# EasyEDA Pro project Ploopy-but-smaller V0.1_2025-08-17.epro, board PCB2
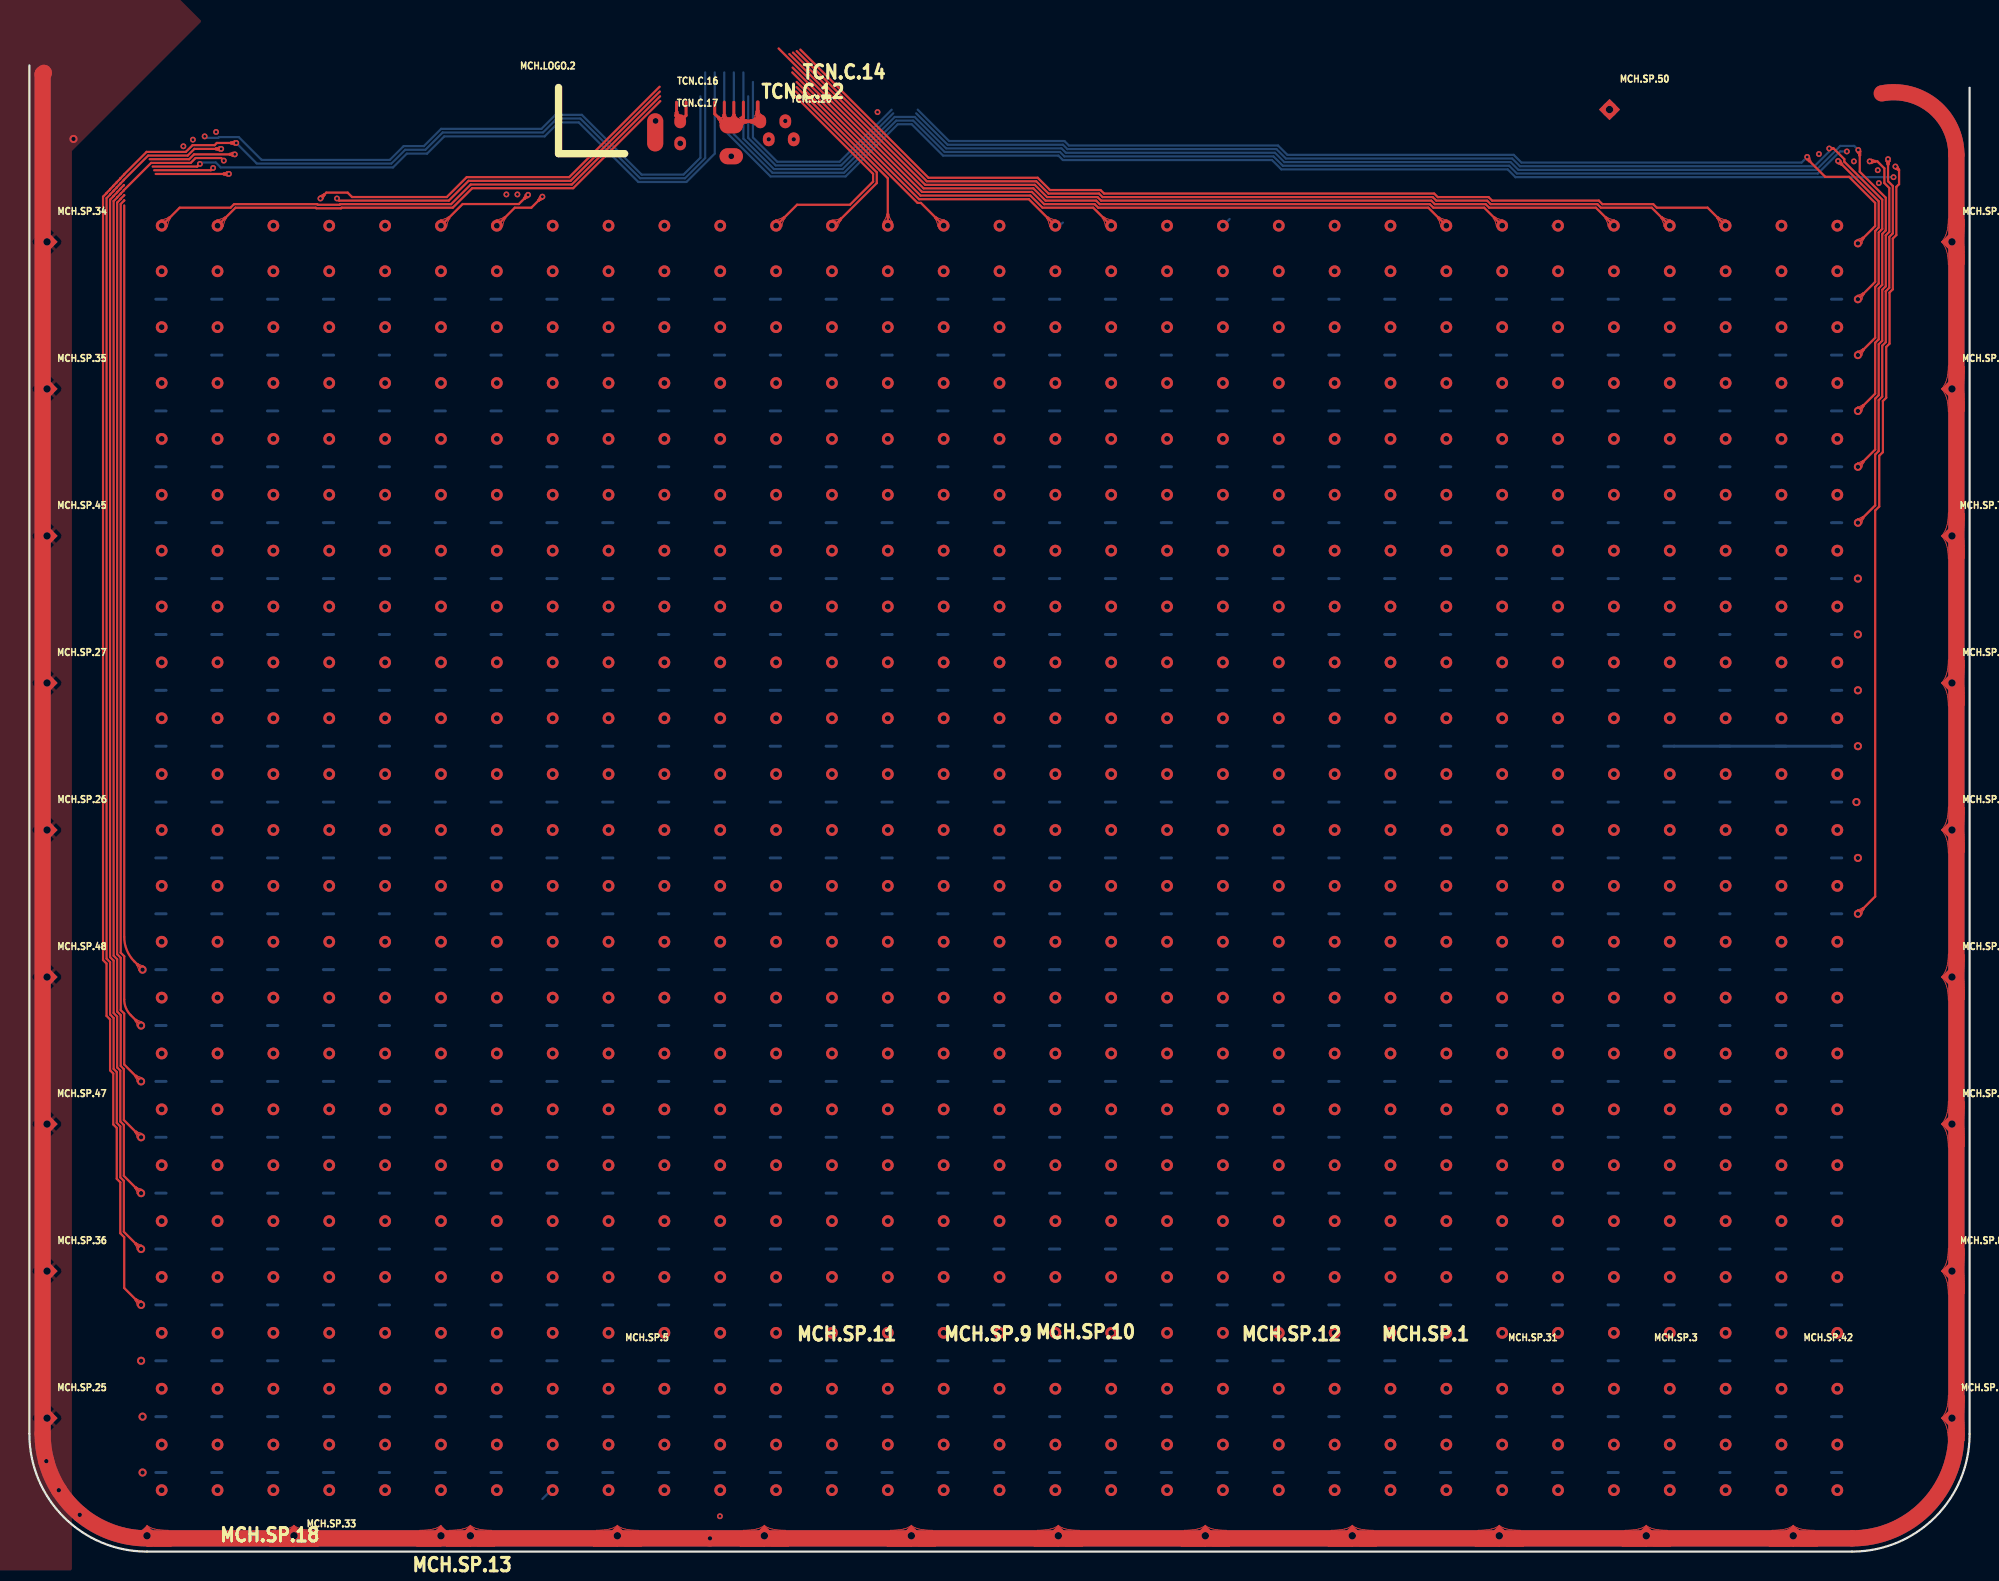
[diagram p2: board, top side]
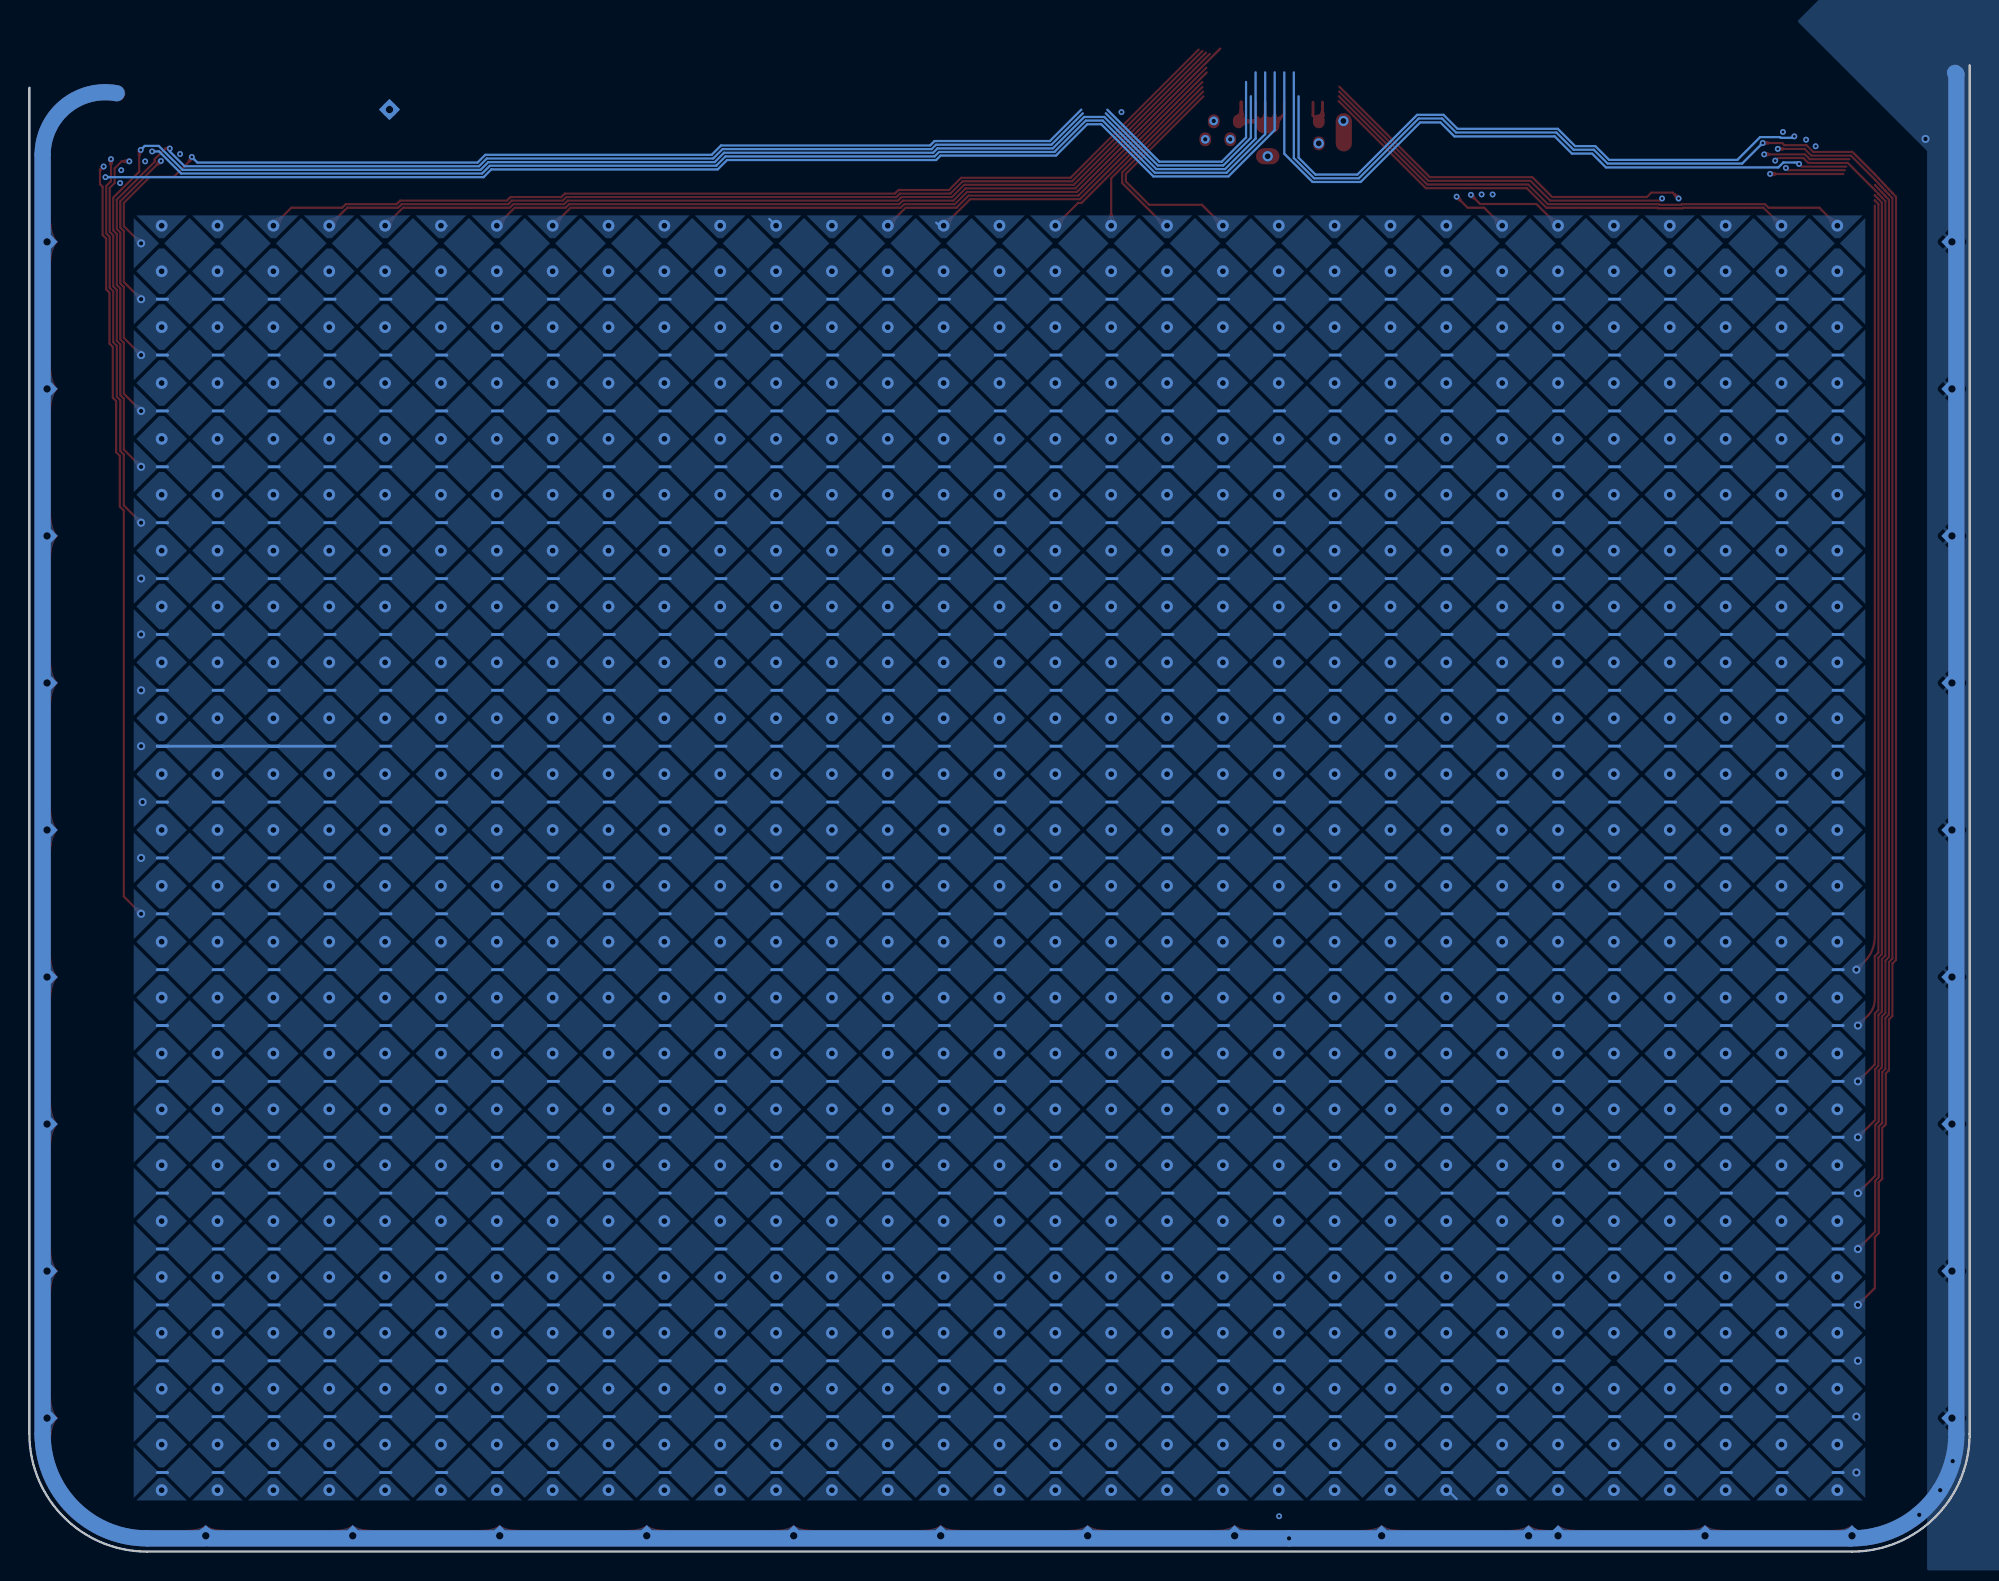
[diagram p3: board, bottom side, seen from below]

Outline 132 x 101.08 mm; copper layers: Top Layer, Inner 1, Inner 2, Inner 3, Inner 4, Bottom Layer. Coordinates in mm from the lower left corner of the outline.
Outline path: 0,101.08 0,8 arc(2.34,2.34) 8,0 124,0 arc(129.66,2.34) 132,8 132,99.56
Stack: Top Layer 0.035mm / Dielectric1 1.51mm FR4 er 4.5 / Inner 1 0.035mm / Dielectric2 0.274mm FR4 er 4.5 / Inner 2 0.035mm / Dielectric3 0.274mm PP er 4.5 / Inner 3 0.035mm / Dielectric4 0.274mm PP er 4.5 / Inner 4 0.035mm / Dielectric5 0.274mm PP er 4.5 / Bottom Layer 0.035mm

## Design rules (mm)
template: JLCPCB Capability(Two Layers Board)
spacing copperThickness1oz (default): track to track 0.102, other pairs 0.152 to 0.3
spacing copperThickness2oz: track to track 0.203, other pairs 0.152 to 0.3
track width copperThickness1oz (default): min 0.127, default 0.254, max 2.54
track width copperThickness2oz: min 0.203, default 0.254, max 2.54
differential pair differentialPair (default): width min 0.127, default 0.254, max 2.54; gap min 0.152, default 0.152
via viaSize (default): diameter min 0.5, default 0.61, max 10; hole min 0.3, default 0.305, max 6.3

## Placement (name value [footprint] x y rotation side)
MCH.LOGO.2  Coordinate system marker for assembly  [Graphics:Coordinate System]  36 95.08 0 top
MCH.SP.1  Spark Gap  [PCBFeatures:SparkGap]  90 1.07 90 top
MCH.SP.3  Spark Gap  [PCBFeatures:SparkGap]  110 1.07 90 top
MCH.SP.5  Spark Gap  [PCBFeatures:SparkGap]  40 1.07 90 top
MCH.SP.7  Spark Gap  [PCBFeatures:SparkGap]  130.8 69.08 90 top
MCH.SP.8  Spark Gap  [PCBFeatures:SparkGap]  130.8 19.08 90 top
MCH.SP.9  Spark Gap  [PCBFeatures:SparkGap]  60 1.07 90 top
MCH.SP.10  Spark Gap  [PCBFeatures:SparkGap]  70 1.07 90 top
MCH.SP.11  Spark Gap  [PCBFeatures:SparkGap]  50 1.07 90 top
MCH.SP.12  Spark Gap  [PCBFeatures:SparkGap]  80 1.07 90 top
MCH.SP.13  Spark Gap  [PCBFeatures:SparkGap]  30 1.07 90 top
MCH.SP.16  Spark Gap  [PCBFeatures:SparkGap]  130.8 89.08 90 top
MCH.SP.17  Spark Gap  [PCBFeatures:SparkGap]  130.8 79.08 90 top
MCH.SP.18  Spark Gap  [PCBFeatures:SparkGap]  8 1.07 90 top
MCH.SP.25  Spark Gap  [PCBFeatures:SparkGap]  1.2 9.08 90 top
MCH.SP.26  Spark Gap  [PCBFeatures:SparkGap]  1.2 49.08 90 top
MCH.SP.27  Spark Gap  [PCBFeatures:SparkGap]  1.2 59.08 90 top
MCH.SP.29  Spark Gap  [PCBFeatures:SparkGap]  130.8 59.08 90 top
MCH.SP.30  Spark Gap  [PCBFeatures:SparkGap]  130.8 39.08 90 top
MCH.SP.31  Spark Gap  [PCBFeatures:SparkGap]  100 1.07 90 top
MCH.SP.32  Spark Gap  [PCBFeatures:SparkGap]  28 1.07 90 top
MCH.SP.33  Spark Gap  [PCBFeatures:SparkGap]  18 1.07 90 top
MCH.SP.34  Spark Gap  [PCBFeatures:SparkGap]  1.2 89.08 90 top
MCH.SP.35  Spark Gap  [PCBFeatures:SparkGap]  1.2 79.08 90 top
MCH.SP.36  Spark Gap  [PCBFeatures:SparkGap]  1.2 19.08 90 top
MCH.SP.39  Spark Gap  [PCBFeatures:SparkGap]  130.8 49.08 90 top
MCH.SP.40  Spark Gap  [PCBFeatures:SparkGap]  130.8 29.08 90 top
MCH.SP.41  Spark Gap  [PCBFeatures:SparkGap]  130.8 9.08 90 top
MCH.SP.42  Spark Gap  [PCBFeatures:SparkGap]  120 1.07 90 top
MCH.SP.45  Spark Gap  [PCBFeatures:SparkGap]  1.2 69.08 90 top
MCH.SP.47  Spark Gap  [PCBFeatures:SparkGap]  1.2 29.08 90 top
MCH.SP.48  Spark Gap  [PCBFeatures:SparkGap]  1.2 39.08 90 top
MCH.SP.50  Spark Gap  [PCBFeatures:SparkGap]  107.5 98.08 90 top
TCN.C.12  0805 X5R  [Chip_Passives:0805 - TALL]  47.75 95.95 180 top
TCN.C.14  0603 X5R  [Chip_Passives:0603 capacitor - CAPC1608X06N]  50.58 97.28 90 top
TCN.C.16  0603 X5R  [Chip_Passives:0603 capacitor - CAPC1608X06N]  43.43 97.28 270 top
TCN.C.17  0603 X5R  [Chip_Passives:0603 capacitor - CAPC1608X06N]  43.43 95.78 270 top
TCN.C.20  0603 X5R  [Chip_Passives:0603 capacitor - CAPC1608X06N]  51.15 96.05 90 top

## Footprints (pads in the part's own frame, mm; a bottom-side part is the same pattern mirrored in y, then rotated)
Chip_Passives:0603 capacitor - CAPC1608X06N
  rrect 0.95x0.8 smd: 1(0,-0.85) 2(0,0.85)
Chip_Passives:0805 - TALL
  rrect 1.6x1.1 smd: 1(0,1.052) 2(0,-1.052)
PCBFeatures:SparkGap
  rect 1.016x1.016 smd rot 45: 1(0,0)
  rect 1.016x1.016 smd far side rot 45: 1(0,0)

## Nets
3V3: TCN.C.17.2 TCN.C.20.2
GND: MCH.SP.1.1 MCH.SP.3.1 MCH.SP.5.1 MCH.SP.7.1 MCH.SP.8.1 MCH.SP.9.1 MCH.SP.10.1 MCH.SP.11.1 MCH.SP.12.1 MCH.SP.13.1 MCH.SP.16.1 MCH.SP.17.1 MCH.SP.18.1 MCH.SP.25.1 MCH.SP.26.1 MCH.SP.27.1 MCH.SP.29.1 MCH.SP.30.1 MCH.SP.31.1 MCH.SP.32.1 MCH.SP.33.1 MCH.SP.34.1 MCH.SP.35.1 MCH.SP.36.1 MCH.SP.39.1 MCH.SP.40.1 MCH.SP.41.1 MCH.SP.42.1 MCH.SP.45.1 MCH.SP.47.1 MCH.SP.48.1 MCH.SP.50.1 TCN.C.12.1 TCN.C.14.1 TCN.C.16.1 TCN.C.17.1 TCN.C.20.1
NETTCN.C.12_2: TCN.C.12.2 TCN.C.14.2 TCN.C.16.2

## Via types
v1: diameter 1.016, hole 0.508, Top Layer to Bottom Layer, 32 vias
v2: diameter 0.6, hole 0.3, Top Layer to Bottom Layer, 3 vias
v3: diameter 0.7, hole 0.4, Top Layer to Bottom Layer, 3 vias
v4: diameter 0.55, hole 0.3, Top Layer to Bottom Layer, 27 vias
v5: diameter 0.7, hole 0.3, Top Layer to Bottom Layer, 1 via
v6: diameter 0.4, hole 0.2, Top Layer to Bottom Layer, 32 vias
v7: diameter 0.8, hole 0.4, Top Layer to Bottom Layer, 744 vias

## Routing (per net, layer and track width the routed paths; a pad name or vN(x,y) marks a point on that pad's centre or on a via; arc(x,y) is an arc through that point)
3V3: length 1.9
  Inner 3 w0.9: 49.73,97.83 49.73,97.44 arc(49.88,96.69) v2(50.3,96.05)
  vias: v3(44.28,95.78)
GND: length 818.9
  Top Layer w1.1: 0.99,100.57 0.9,100.48 0.9,8 arc(0.96,7.07) 1.15,6.15 arc(1.5,5.13) 2.01,4.18 arc(2.67,3.31) 3.46,2.54 arc(5.59,1.32) 8,0.9 ; v5(46.3,0.9) 8.1,0.9 8,1 arc(8.11,0.93) 8.24,0.9 ; TCN.C.17.1 TCN.C.16.1 ; 120.1,0.9 124,0.9 arc(129.02,2.98) 131.1,8 131.1,95 arc(129.55,98.29) 126.02,99.18 ; 46.28,0.9 119.76,0.9 ; 120.1,0.97 arc(120.03,1) v1(120,1.07) arc(119.89,1) 119.76,0.97
  Inner 1 w1.1: 41.6,0.9 v5(46.3,0.9) 49.9,0.9
  Inner 2 w0.6: 49.55,99.63 49.55,97.63 47.75,95.83 47.75,95.03 ; 49.99,99.19 49.99,97.27 47.75,95.03 ; 47.75,95.03 v3(47.75,94.9) ; v2(51.43,97.3) 51.43,97.35 arc(51.23,98.32) 50.68,99.15 ; v2(51.43,97.3) arc(51.34,97.72) 51.11,98.07 ; v2(51.43,97.3) arc(51.55,96.68) 51.9,96.15 v2(52,96.05) 52,97.45 arc(51.81,98.42) 51.26,99.25
  Inner 2 w1.1: v5(46.3,0.9) 8.1,0.9 ; 120.1,0.9 124,0.9 arc(129.02,2.98) 131.1,8 ; v3(42.6,97.3) 42.6,98.4 ; 46.28,0.9 119.76,0.9 ; 0.9,8 arc(0.96,7.07) 1.15,6.15 arc(1.5,5.13) 2.01,4.18 arc(2.67,3.31) 3.46,2.54 arc(5.59,1.32) 8,0.9
  Inner 3 w1.1: v1(50,1.07) arc(49.97,1) 49.9,0.97
  Bottom Layer w1.1: 0.99,100.57 0.9,100.48 0.9,8 arc(0.96,7.07) 1.15,6.15 arc(1.5,5.13) 2.01,4.18 arc(2.67,3.31) 3.46,2.54 arc(5.59,1.32) 8,0.9 ; 8,1 8.1,0.9 v5(46.3,0.9) ; 120.1,0.9 124,0.9 arc(129.02,2.98) 131.1,8 131.1,95 arc(129.56,98.27) 126.06,99.19 ; 46.28,0.9 119.76,0.9 ; 8.24,0.97 arc(8.11,1) v1(8,1.07) ; 119.76,0.97 arc(119.89,1) v1(120,1.07) arc(120.03,1) 120.1,0.97
  vias: v1(1.2,89.08) v1(1.2,79.08) v1(1.2,69.08) v1(1.2,59.08) v1(1.2,49.08) v1(1.2,39.08) v1(1.2,29.08) v1(1.2,19.08) v1(1.2,9.08) v1(18,1.07) v1(28,1.07) v1(30,1.07) v1(40,1.07) v1(60,1.07) v1(70,1.07) v1(80,1.07) v1(90,1.07) v1(100,1.07) v1(107.5,98.08) v1(110,1.07) v1(130.8,89.08) v1(130.8,79.08) v1(130.8,69.08) v1(130.8,59.08) v1(130.8,49.08) v1(130.8,39.08) v1(130.8,29.08) v1(130.8,19.08) v1(130.8,9.08) v4(1.15,6.15) v4(2,4.18) v4(3,96.08) v4(3.43,2.5)
DRIVENSHIELD: length 493.4
  Inner 2 w0.05: 46.65,2.55 46.86,2.56 46.86,2.25 46.84,2.25 46.83,2.25 46.78,2.25 46.65,2.25 46.65,2.55
  Inner 2 w0.3: 58.67,96.55 59.33,96.55 61.7,94.18 69.45,94.18 69.7,93.93 84.13,93.93 84.83,93.23 100.08,93.23 100.58,92.73 123.15,92.73 124.2,91.68 ; 56.88,94.25 55.58,92.95 43.11,92.95 ; 47.88,2.4 125.6,2.4 125.9,2.7 125.9,43.3 126.53,43.93 126.53,47.68 126.75,47.9 126.75,51.35 126.95,51.55 126.95,54.8 127.28,55.13 127.28,58.78 127.5,59 127.5,62.48 127.7,62.68 127.7,66.1 128.08,66.48 128.08,94.55 126.13,96.5 120.82,96.5 119.58,95.25 101.8,95.25 101.33,95.73 85.95,95.73 85.33,96.35 71.28,96.35 71,96.63 62.95,96.63 60.8,98.78 ; 37.47,97.37 35.7,95.6 28.55,95.6 27.4,94.45 26.53,94.45 25.4,93.33 18.3,93.33 17.65,92.68 9.5,92.68 8.5,91.68 ; 7.97,91.68 7.09,91.68 4.42,89.02 4.42,31.36 4.95,30.83 4.95,4.41 6.96,2.4 46.96,2.4 ; 57.7,97.88 v6(57.7,97.9)
  Inner 3 w0.3: v6(46.98,2.4) 52.85,2.4
NETTCN.C.12_2: length 13.8
  Top Layer w0.2: 44.68,98.58 44.68,97.68 44.28,97.28 44.03,97.53 44.03,98.58 ; TCN.C.12.2 47.4,97.01 46.63,97.78 46.63,98.58 ; TCN.C.12.2 48,97.01 48.58,97.58 48.58,98.58 ; TCN.C.12.2 47.93,97.18 47.93,98.58 ; TCN.C.12.2 47.28,97.48 47.28,98.58
  Top Layer w0.25: 47.93,97.18 48.02,97.28 TCN.C.14.2 49.55,97.45 49.55,98.58
X0: length 123.9
  Top Layer w0.15: 42.91,98.98 36.91,92.98 30.03,92.98 28.69,91.64 21.14,91.64 21.1,91.6 19.62,91.6 19.58,91.64 13.93,91.64 13.69,91.4 10.23,91.4 v7(9,90.18)
  Inner 1 w0.15: 9,4.26 v7(9,7.28) v7(9,11.08) v7(9,14.88) v7(9,18.68) v7(9,22.48) v7(9,26.28) v7(9,30.08) v7(9,33.88) v7(9,37.68) v7(9,41.48) v7(9,45.28) v7(9,49.08) v7(9,52.88) v7(9,56.68) v7(9,60.48) v7(9,64.28) v7(9,68.08) v7(9,71.88) v7(9,75.68) v7(9,79.48) v7(9,83.28) v7(9,87.08) v7(9,90.18) 9.01,90.18 ; 9.18,4.08 8.99,4.26 ; 9,4.08 v7(9,4.18)
X1: length 119.8
  Top Layer w0.15: v7(12.8,90.18) 14.03,91.4 19.48,91.4 19.52,91.36 21.2,91.36 21.24,91.4 28.8,91.4 30.13,92.73 37,92.73 42.92,98.65
  Inner 1 w0.15: v7(12.8,90.18) v7(12.8,87.08) v7(12.8,83.28) v7(12.8,79.48) v7(12.8,75.68) v7(12.8,71.88) v7(12.8,68.08) v7(12.8,64.28) v7(12.8,60.48) v7(12.8,56.68) v7(12.8,52.88) v7(12.8,49.08) v7(12.8,45.28) v7(12.8,41.48) v7(12.8,37.68) v7(12.8,33.88) v7(12.8,30.08) v7(12.8,26.28) v7(12.8,22.48) v7(12.8,18.68) v7(12.8,14.88) v7(12.8,11.08) v7(12.8,7.28) 12.8,4
  vias: v7(12.8,4.18)
X2: length 116.9
  Top Layer w0.15: v6(19.8,92.03) 20.2,92.43 21.65,92.43 21.95,92.13 28.4,92.13 29.75,93.48 36.73,93.48 42.88,99.63
  Inner 1 w0.15: 16.6,4.08 v7(16.6,4.18) v7(16.6,7.28) v7(16.6,11.08) v7(16.6,14.88) v7(16.6,18.68) v7(16.6,22.48) v7(16.6,26.28) v7(16.6,30.08) v7(16.6,33.88) v7(16.6,37.68) v7(16.6,41.48) v7(16.6,45.28) v7(16.6,49.08) v7(16.6,52.88) v7(16.6,56.68) v7(16.6,60.48) v7(16.6,64.28) v7(16.6,68.08) v7(16.6,71.88) v7(16.6,75.68) v7(16.6,79.48) v7(16.6,83.28) v7(16.6,87.08) v7(16.6,90.18) 18.45,92.03 v6(19.8,92.03)
  Bottom Layer w0.15: v7(16.6,90.18) 16.86,90.44
X3: length 113.4
  Top Layer w0.15: 42.89,99.3 36.82,93.23 29.88,93.23 28.53,91.88 21.07,91.88 v6(20.93,92.03)
  Inner 1 w0.15: v6(20.93,92.03) 20.4,91.5 v7(20.4,90.18) v7(20.4,87.08) v7(20.4,83.28) v7(20.4,79.48) v7(20.4,75.68) v7(20.4,71.88) v7(20.4,68.08) v7(20.4,64.28) v7(20.4,60.48) v7(20.4,56.68) v7(20.4,52.88) v7(20.4,49.08) v7(20.4,45.28) v7(20.4,41.48) v7(20.4,37.68) v7(20.4,33.88) v7(20.4,30.08) v7(20.4,26.28) v7(20.4,22.48) v7(20.4,18.68) v7(20.4,14.88) v7(20.4,11.08) v7(20.4,7.28) 20.4,4.26 ; 20.4,4.08 v7(20.4,4.18)
  Bottom Layer w0.15: v7(20.4,90.18) 20.52,90.3
X14: length 108.6
  Inner 1 w0.15: v7(24.2,7.28) v7(24.2,11.08) v7(24.2,14.88) v7(24.2,18.68) v7(24.2,22.48) v7(24.2,26.28) v7(24.2,30.08) v7(24.2,33.88) v7(24.2,37.68) v7(24.2,41.48) v7(24.2,45.28) v7(24.2,49.08) v7(24.2,52.88) v7(24.2,56.68) v7(24.2,60.48) v7(24.2,64.28) v7(24.2,68.08) v7(24.2,71.88) v7(24.2,75.68) v7(24.2,79.48) v7(24.2,83.28) v7(24.2,87.08) v7(24.2,90.18) 25.43,91.4 35.08,91.4 42.83,99.15 ; 24.2,4.08 24.2,7.28 ; 24.2,4.08 v7(24.2,4.18) ; 24.2,4.08 24.2,4
X15: length 104.7
  Top Layer w0.15: v6(33.93,92.28) 33.3,91.65 29.48,91.65 v7(28,90.18)
  Inner 1 w0.15: 42.3,100.43 34.68,92.8 34.45,92.8 v6(33.93,92.28) ; v7(28,7.28) v7(28,11.08) v7(28,14.88) v7(28,18.68) v7(28,22.48) v7(28,26.28) v7(28,30.08) v7(28,33.88) v7(28,37.68) v7(28,41.48) v7(28,45.28) v7(28,49.08) v7(28,52.88) v7(28,56.68) v7(28,60.48) v7(28,64.28) v7(28,68.08) v7(28,71.88) v7(28,75.68) v7(28,79.48) v7(28,83.28) v7(28,87.08) v7(28,90.18) ; 28,4.11 28,7.28 ; 28,4.08 v7(28,4.18)
X16: length 101.1
  Top Layer w0.15: v7(31.8,90.18) 33.03,91.4 34.15,91.4 v6(34.9,92.15)
  Inner 1 w0.15: v7(31.8,90.18) v7(31.8,87.08) v7(31.8,83.28) v7(31.8,79.48) v7(31.8,75.68) v7(31.8,71.88) v7(31.8,68.08) v7(31.8,64.28) v7(31.8,60.48) v7(31.8,56.68) v7(31.8,52.88) v7(31.8,49.08) v7(31.8,45.28) v7(31.8,41.48) v7(31.8,37.68) v7(31.8,33.88) v7(31.8,30.08) v7(31.8,26.28) v7(31.8,22.48) v7(31.8,18.68) v7(31.8,14.88) v7(31.8,11.08) v7(31.8,7.28) 31.8,4.26 ; v6(34.9,92.15) 42.8,100.05 ; 31.8,4.08 v7(31.8,4.18)
X17: length 103.8
  Inner 1 w0.15: 35.6,4 v7(35.6,7.28) v7(35.6,11.08) v7(35.6,14.88) v7(35.6,18.68) v7(35.6,22.48) v7(35.6,26.28) v7(35.6,30.08) v7(35.6,33.88) v7(35.6,37.68) v7(35.6,41.48) v7(35.6,45.28) v7(35.6,49.08) v7(35.6,52.88) v7(35.6,56.68) v7(35.6,60.48) v7(35.6,64.28) v7(35.6,68.08) v7(35.6,71.88) v7(35.6,75.68) v7(35.6,79.48) v7(35.6,83.28) v7(35.6,87.08) v7(35.6,90.18) ; v6(32.45,92.3) 32.65,92.3 33.65,93.3 34.43,93.3 41.8,100.68
  Inner 3 w0.15: v6(32.45,92.3) 33.35,91.4 34.38,91.4 v7(35.6,90.18)
  Bottom Layer w0.15: 34.9,3.58 35.43,4.11
  vias: v7(35.6,4.18)
X18: length 105.4
  Inner 1 w0.15: v7(39.4,90.18) v7(39.4,87.08) v7(39.4,83.28) v7(39.4,79.48) v7(39.4,75.68) v7(39.4,71.88) v7(39.4,68.08) v7(39.4,64.28) v7(39.4,60.48) v7(39.4,56.68) v7(39.4,52.88) v7(39.4,49.08) v7(39.4,45.28) v7(39.4,41.48) v7(39.4,37.68) v7(39.4,33.88) v7(39.4,30.08) v7(39.4,26.28) v7(39.4,22.48) v7(39.4,18.68) v7(39.4,14.88) v7(39.4,11.08) v7(39.4,7.28) v7(39.4,4.18) 39.4,4.08 ; v6(33.2,92.3) 33.4,92.3 34.15,93.05 34.55,93.05 42.05,100.55
  Inner 3 w0.15: v6(33.2,92.3) 33.85,91.65 35.08,91.65 35.35,91.38 38.2,91.38 v7(39.4,90.18)
X19: length 94.3
  Inner 1 w0.15: 43.2,4.08 v7(43.2,4.18) ; 43.2,98.43 v7(43.2,90.18) v7(43.2,87.08) v7(43.2,83.28) v7(43.2,79.48) v7(43.2,75.68) v7(43.2,71.88) v7(43.2,68.08) v7(43.2,64.28) v7(43.2,60.48) v7(43.2,56.68) v7(43.2,52.88) v7(43.2,49.08) v7(43.2,45.28) v7(43.2,41.48) v7(43.2,37.68) v7(43.2,33.88) v7(43.2,30.08) v7(43.2,26.28) v7(43.2,22.48) v7(43.2,18.68) v7(43.2,14.88) v7(43.2,11.08) v7(43.2,7.28) 43.2,4.26
X20: length 97.8
  Inner 1 w0.15: 47,4 v7(47,7.28) v7(47,11.08) v7(47,14.88) v7(47,18.68) v7(47,22.48) v7(47,26.28) v7(47,30.08) v7(47,33.88) v7(47,37.68) v7(47,41.48) v7(47,45.28) v7(47,49.08) v7(47,52.88) v7(47,56.68) v7(47,60.48) v7(47,64.28) v7(47,68.08) v7(47,71.88) v7(47,75.68) v7(47,79.48) v7(47,83.28) v7(47,87.08) v7(47,90.18) 45.85,91.33 44.25,91.33 43.45,92.13 43.45,97.65 44.65,98.85
  vias: v7(47,4.18)
X21: length 101.9
  Top Layer w0.15: v7(50.8,90.18) 52.23,91.6 55.83,91.6 57.4,93.18 57.4,93.7 52.13,98.98
  Inner 1 w0.15: v7(50.8,90.18) v7(50.8,87.08) v7(50.8,83.28) v7(50.8,79.48) v7(50.8,75.68) v7(50.8,71.88) v7(50.8,68.08) v7(50.8,64.28) v7(50.8,60.48) v7(50.8,56.68) v7(50.8,52.88) v7(50.8,49.08) v7(50.8,45.28) v7(50.8,41.48) v7(50.8,37.68) v7(50.8,33.88) v7(50.8,30.08) v7(50.8,26.28) v7(50.8,22.48) v7(50.8,18.68) v7(50.8,14.88) v7(50.8,11.08) v7(50.8,7.28) v7(50.8,4.18) 50.8,4.08
X22: length 98.8
  Top Layer w0.15: 52.15,99.3 57.65,93.8 57.65,93.08 54.75,90.18 v7(54.6,90.18)
  Inner 1 w0.15: 54.6,4.26 v7(54.6,7.28) v7(54.6,11.08) v7(54.6,14.88) v7(54.6,18.68) v7(54.6,22.48) v7(54.6,26.28) v7(54.6,30.08) v7(54.6,33.88) v7(54.6,37.68) v7(54.6,41.48) v7(54.6,45.28) v7(54.6,49.08) v7(54.6,52.88) v7(54.6,56.68) v7(54.6,60.48) v7(54.6,64.28) v7(54.6,68.08) v7(54.6,71.88) v7(54.6,75.68) v7(54.6,79.48) v7(54.6,83.28) v7(54.6,87.08) v7(54.6,90.18) ; 54.6,4.08 v7(54.6,4.18)
X23: length 98.4
  Top Layer w0.15: v7(58.4,90.18) 58.4,93.4 52.2,99.61
  Inner 1 w0.15: 58.4,4 v7(58.4,7.28) v7(58.4,11.08) v7(58.4,14.88) v7(58.4,18.68) v7(58.4,22.48) v7(58.4,26.28) v7(58.4,30.08) v7(58.4,33.88) v7(58.4,37.68) v7(58.4,41.48) v7(58.4,45.28) v7(58.4,49.08) v7(58.4,52.88) v7(58.4,56.68) v7(58.4,60.48) v7(58.4,64.28) v7(58.4,68.08) v7(58.4,71.88) v7(58.4,75.68) v7(58.4,79.48) v7(58.4,83.28) v7(58.4,87.08) v7(58.4,90.18)
  Bottom Layer w0.15: 58.57,90.25 arc(58.49,90.2) v7(58.4,90.18)
  vias: v7(58.4,4.18)
X24: length 100.1
  Top Layer w0.15: v7(62.2,90.18) 60.65,91.73 60.43,91.73 52.2,99.95
  Inner 1 w0.15: v7(62.2,90.18) v7(62.2,87.08) v7(62.2,83.28) v7(62.2,79.48) v7(62.2,75.68) v7(62.2,71.88) v7(62.2,68.08) v7(62.2,64.28) v7(62.2,60.48) v7(62.2,56.68) v7(62.2,52.88) v7(62.2,49.08) v7(62.2,45.28) v7(62.2,41.48) v7(62.2,37.68) v7(62.2,33.88) v7(62.2,30.08) v7(62.2,26.28) v7(62.2,22.48) v7(62.2,18.68) v7(62.2,14.88) v7(62.2,11.08) v7(62.2,7.28) v7(62.2,4.18) 62.2,4.08
X25: length 105.2
  Inner 1 w0.15: 66,4.08 v7(66,4.18) ; 66,4.26 v7(66,7.28) v7(66,11.08) v7(66,14.88) v7(66,18.68) v7(66,22.48) v7(66,26.28) v7(66,30.08) v7(66,33.88) v7(66,37.68) v7(66,41.48) v7(66,45.28) v7(66,49.08) v7(66,52.88) v7(66,56.68) v7(66,60.48) v7(66,64.28) v7(66,68.08) v7(66,71.88) v7(66,75.68) v7(66,79.48) v7(66,83.28) v7(66,87.08) v7(66,90.18) 64.78,91.4 59.85,91.4 50.98,100.28
X26: length 109
  Top Layer w0.15: v7(69.8,90.18) 68,91.98 60.53,91.98 51.9,100.6
  Inner 1 w0.15: 69.8,4 v7(69.8,7.28) v7(69.8,11.08) v7(69.8,14.88) v7(69.8,18.68) v7(69.8,22.48) v7(69.8,26.28) v7(69.8,30.08) v7(69.8,33.88) v7(69.8,37.68) v7(69.8,41.48) v7(69.8,45.28) v7(69.8,49.08) v7(69.8,52.88) v7(69.8,56.68) v7(69.8,60.48) v7(69.8,64.28) v7(69.8,68.08) v7(69.8,71.88) v7(69.8,75.68) v7(69.8,79.48) v7(69.8,83.28) v7(69.8,87.08) v7(69.8,90.18)
  Bottom Layer w0.15: 70.31,90.39 arc(70.08,90.23) v7(69.8,90.18)
  vias: v7(69.8,4.18)
X27: length 112.2
  Top Layer w0.15: 51.93,100.93 60.63,92.23 68.1,92.23 68.93,91.4 72.38,91.4 v7(73.6,90.18)
  Inner 1 w0.15: 73.6,4.11 v7(73.6,7.28) v7(73.6,11.08) v7(73.6,14.88) v7(73.6,18.68) v7(73.6,22.48) v7(73.6,26.28) v7(73.6,30.08) v7(73.6,33.88) v7(73.6,37.68) v7(73.6,41.48) v7(73.6,45.28) v7(73.6,49.08) v7(73.6,52.88) v7(73.6,56.68) v7(73.6,60.48) v7(73.6,64.28) v7(73.6,68.08) v7(73.6,71.88) v7(73.6,75.68) v7(73.6,79.48) v7(73.6,83.28) v7(73.6,87.08) v7(73.6,90.18)
  vias: v7(73.6,4.18)
X28: length 117.2
  Inner 1 w0.15: 77.4,4.08 v7(77.4,4.18) ; 77.4,4.26 v7(77.4,7.28) v7(77.4,11.08) v7(77.4,14.88) v7(77.4,18.68) v7(77.4,22.48) v7(77.4,26.28) v7(77.4,30.08) v7(77.4,33.88) v7(77.4,37.68) v7(77.4,41.48) v7(77.4,45.28) v7(77.4,49.08) v7(77.4,52.88) v7(77.4,56.68) v7(77.4,60.48) v7(77.4,64.28) v7(77.4,68.08) v7(77.4,71.88) v7(77.4,75.68) v7(77.4,79.48) v7(77.4,83.28) v7(77.4,87.08) v7(77.4,90.18) 76.18,91.4 65.13,91.4 64.88,91.65 59.98,91.65 50.7,100.93
X29: length 121.9
  Inner 1 w0.15: 81.2,4 v7(81.2,7.28) v7(81.2,11.08) v7(81.2,14.88) v7(81.2,18.68) v7(81.2,22.48) v7(81.2,26.28) v7(81.2,30.08) v7(81.2,33.88) v7(81.2,37.68) v7(81.2,41.48) v7(81.2,45.28) v7(81.2,49.08) v7(81.2,52.88) v7(81.2,56.68) v7(81.2,60.48) v7(81.2,64.28) v7(81.2,68.08) v7(81.2,71.88) v7(81.2,75.68) v7(81.2,79.48) v7(81.2,83.28) v7(81.2,87.08) v7(81.2,90.18) 79.98,91.4 76.53,91.4 76.28,91.65 65.23,91.65 64.98,91.9 60.1,91.9 50.75,101.25
  Bottom Layer w0.15: v7(81.2,90.18) 81.66,90.63
  vias: v7(81.2,4.18)
X30: length 124.9
  Inner 1 w0.15: 85,4.08 v7(85,4.18) v7(85,7.28) v7(85,11.08) v7(85,14.88) v7(85,18.68) v7(85,22.48) v7(85,26.28) v7(85,30.08) v7(85,33.88) v7(85,37.68) v7(85,41.48) v7(85,45.28) v7(85,49.08) v7(85,52.88) v7(85,56.68) v7(85,60.48) v7(85,64.28) v7(85,68.08) v7(85,71.88) v7(85,75.68) v7(85,79.48) v7(85,83.28) v7(85,87.08) 85,90.08 ; v7(85,90.18) 83.78,91.4 80.33,91.4 80.08,91.65 76.63,91.65 76.38,91.9 65.34,91.9 65.09,92.15 60.28,92.15 50.85,101.58
X31: length 128.8
  Inner 1 w0.15: v7(88.8,90.18) 87.58,91.4 84.13,91.4 83.88,91.65 80.43,91.65 80.18,91.9 76.74,91.9 76.49,92.15 65.44,92.15 65.19,92.4 60.45,92.4 50.95,101.9 ; v7(88.8,90.18) v7(88.8,87.08) v7(88.8,83.28) v7(88.8,79.48) v7(88.8,75.68) v7(88.8,71.88) v7(88.8,68.08) v7(88.8,64.28) v7(88.8,60.48) v7(88.8,56.68) v7(88.8,52.88) v7(88.8,49.08) v7(88.8,45.28) v7(88.8,41.48) v7(88.8,37.68) v7(88.8,33.88) v7(88.8,30.08) v7(88.8,26.28) v7(88.8,22.48) v7(88.8,18.68) v7(88.8,14.88) v7(88.8,11.08) v7(88.8,7.28) 88.8,4.26 ; v7(88.8,90.18) arc(88.82,90.27) 88.87,90.35
  vias: v7(88.8,4.18)
X32: length 125.1
  Inner 1 w0.15: 92.6,4 v7(92.6,7.28) ; 51.08,102.15 60.58,92.65 65.29,92.65 65.54,92.4 76.59,92.4 76.84,92.15 80.29,92.15 80.54,91.9 83.98,91.9 84.23,91.65 87.68,91.65 87.93,91.4 91.38,91.4 v7(92.6,90.18) v7(92.6,87.08) v7(92.6,83.28) v7(92.6,79.48) v7(92.6,75.68) v7(92.6,71.88) v7(92.6,68.08) v7(92.6,64.28) v7(92.6,60.48) v7(92.6,56.68) v7(92.6,52.88) v7(92.6,49.08) v7(92.6,45.28) v7(92.6,41.48) v7(92.6,37.68) v7(92.6,33.88) v7(92.6,30.08) v7(92.6,26.28) v7(92.6,22.48) v7(92.6,18.68) v7(92.6,14.88)
  vias: v7(92.6,11.08) v7(92.6,4.18)
X33: length 136.5
  Top Layer w0.15: 50.98,102.23 60.73,92.48 68.2,92.48 69.04,91.64 72.48,91.64 72.72,91.4 95.18,91.4 v7(96.4,90.18)
  Inner 1 w0.15: 96.4,4.08 v7(96.4,4.18) v7(96.4,7.28) v7(96.4,11.08) v7(96.4,14.88) v7(96.4,18.68) v7(96.4,22.48) v7(96.4,26.28) v7(96.4,30.08) v7(96.4,33.88) v7(96.4,37.68) v7(96.4,41.48) v7(96.4,45.28) v7(96.4,49.08) v7(96.4,52.88) v7(96.4,56.68) v7(96.4,60.48) v7(96.4,64.28) v7(96.4,68.08) v7(96.4,71.88) v7(96.4,75.68) v7(96.4,79.48) v7(96.4,83.28) v7(96.4,87.08) v7(96.4,90.18)
X34: length 139.5
  Top Layer w0.15: v7(100.2,90.18) 98.98,91.4 95.52,91.4 95.28,91.64 72.82,91.64 72.58,91.88 69.14,91.88 68.3,92.72 60.84,92.72 51.7,101.85
  Inner 1 w0.15: 100.2,4.08 v7(100.2,4.18) ; 100.2,4.26 v7(100.2,7.28) v7(100.2,11.08) v7(100.2,14.88) v7(100.2,18.68) v7(100.2,22.48) v7(100.2,26.28) v7(100.2,30.08) v7(100.2,33.88) v7(100.2,37.68) v7(100.2,41.48) v7(100.2,49.08) v7(100.2,52.88) v7(100.2,56.68) v7(100.2,60.48) v7(100.2,64.28) v7(100.2,68.08) v7(100.2,71.88) v7(100.2,75.68) v7(100.2,79.48) v7(100.2,83.28) v7(100.2,87.08) v7(100.2,90.18) 100.2,90.38
  vias: v7(100.2,45.28)
X35: length 144.4
  Inner 1 w0.15: 51.2,102.4 60.7,92.9 65.4,92.9 65.65,92.65 76.69,92.65 76.94,92.4 80.39,92.4 80.64,92.15 84.09,92.15 84.34,91.9 87.78,91.9 88.03,91.65 91.48,91.65 91.73,91.4 102.78,91.4 v7(104,90.18) v7(104,87.08) v7(104,83.28) v7(104,79.48) v7(104,75.68) v7(104,71.88) v7(104,68.08) v7(104,64.28) v7(104,60.48) v7(104,56.68) v7(104,52.88) v7(104,49.08) v7(104,45.28) v7(104,41.48) v7(104,37.68) v7(104,33.88) v7(104,30.08) v7(104,26.28) v7(104,22.48) v7(104,18.68) v7(104,14.88) v7(104,11.08) v7(104,7.28) 104,4
  Bottom Layer w0.15: 103.6,90.18 v7(104,90.18)
  vias: v7(104,4.18)
X36: length 147
  Top Layer w0.15: 51.95,101.95 60.95,92.96 68.4,92.96 69.24,92.12 72.68,92.12 72.92,91.88 95.38,91.88 95.62,91.64 99.08,91.64 99.32,91.4 106.58,91.4 v7(107.8,90.18)
  Inner 1 w0.15: 107.7,90.28 v7(107.8,90.18) v7(107.8,87.08) v7(107.8,83.28) v7(107.8,79.48) v7(107.8,75.68) v7(107.8,71.88) v7(107.8,68.08) v7(107.8,64.28) v7(107.8,60.48) v7(107.8,56.68) v7(107.8,52.88) v7(107.8,49.08) v7(107.8,45.28) v7(107.8,41.48) v7(107.8,37.68) v7(107.8,33.88) v7(107.8,30.08) v7(107.8,26.28) v7(107.8,22.48) v7(107.8,18.68) v7(107.8,14.88) v7(107.8,11.08) v7(107.8,7.28) 107.8,4.11 ; 107.8,4.08 v7(107.8,4.18)
X37: length 150.5
  Top Layer w0.15: 52.2,102.05 61.06,93.2 68.5,93.2 69.34,92.36 72.77,92.36 73.01,92.12 95.47,92.12 95.72,91.88 99.18,91.88 99.42,91.64 106.68,91.64 106.92,91.4 110.38,91.4 v7(111.6,90.18)
  Inner 1 w0.15: 111.6,4.26 v7(111.6,7.28) v7(111.6,11.08) v7(111.6,14.88) v7(111.6,18.68) v7(111.6,22.48) v7(111.6,26.28) v7(111.6,30.08) v7(111.6,33.88) v7(111.6,37.68) v7(111.6,41.48) v7(111.6,45.28) v7(111.6,49.08) v7(111.6,52.88) v7(111.6,56.68) v7(111.6,60.48) v7(111.6,64.28) v7(111.6,68.08) v7(111.6,71.88) v7(111.6,75.68) v7(111.6,79.48) v7(111.6,83.28) v7(111.6,87.08) v7(111.6,90.18) 111.52,90.26 ; 111.6,4.08 v7(111.6,4.18)
X38: length 154.1
  Top Layer w0.15: v7(115.4,90.18) 114.18,91.4 110.72,91.4 110.48,91.64 107.02,91.64 106.78,91.88 99.52,91.88 99.28,92.12 95.81,92.12 95.57,92.36 73.11,92.36 72.87,92.6 69.43,92.6 68.6,93.44 61.17,93.44 52.45,102.15
  Inner 1 w0.15: 115.4,4 v7(115.4,7.28) v7(115.4,11.08) v7(115.4,14.88) v7(115.4,18.68) v7(115.4,22.48) v7(115.4,26.28) v7(115.4,30.08) v7(115.4,33.88) v7(115.4,37.68) v7(115.4,41.48) v7(115.4,45.28) v7(115.4,49.08) v7(115.4,52.88) v7(115.4,56.68) v7(115.4,60.48) v7(115.4,64.28) v7(115.4,68.08) v7(115.4,71.88) v7(115.4,75.68) v7(115.4,79.48) v7(115.4,83.28) v7(115.4,87.08) v7(115.4,90.18)
  vias: v7(115.4,4.18)
X39: length 160.4
  Inner 1 w0.15: 119.2,4.08 v7(119.2,4.18) v7(119.2,7.28) v7(119.2,11.08) v7(119.2,14.88) v7(119.2,18.68) v7(119.2,22.48) v7(119.2,26.28) v7(119.2,30.08) v7(119.2,33.88) v7(119.2,37.68) v7(119.2,41.48) v7(119.2,45.28) v7(119.2,49.08) v7(119.2,52.88) v7(119.2,56.68) v7(119.2,60.48) v7(119.2,64.28) v7(119.2,68.08) v7(119.2,71.88) v7(119.2,75.68) v7(119.2,79.48) v7(119.2,83.28) v7(119.2,87.08) v7(119.2,90.18) 117.98,91.4 103.13,91.4 102.88,91.65 91.83,91.65 91.58,91.9 88.14,91.9 87.89,92.15 84.44,92.15 84.19,92.4 80.74,92.4 80.49,92.65 77.05,92.65 76.8,92.9 65.75,92.9 65.5,93.15 60.83,93.15 50.45,103.53
X40: length 163.8
  Inner 1 w0.15: 123,4.08 v7(123,4.18) v7(123,7.28) v7(123,11.08) v7(123,14.88) v7(123,22.48) v7(123,26.28) v7(123,30.08) v7(123,33.88) v7(123,37.68) v7(123,41.48) v7(123,45.28) v7(123,49.08) v7(123,52.88) v7(123,56.68) v7(123,60.48) v7(123,68.08) v7(123,71.88) v7(123,75.68) v7(123,79.48) v7(123,83.28) v7(123,87.08) v7(123,90.18) 121.78,91.4 118.33,91.4 118.08,91.65 103.23,91.65 102.98,91.9 91.94,91.9 91.69,92.15 88.24,92.15 87.99,92.4 84.54,92.4 84.29,92.65 80.85,92.65 80.6,92.9 77.15,92.9 76.9,93.15 65.86,93.15 65.61,93.4 60.95,93.4 50.85,103.5
  vias: v7(123,64.28) v7(123,18.68)
Y2: length 137.8
  Inner 1 w0.05: 7.27,5.71 7.37,5.81 7.4,5.79 7.43,5.76 7.46,5.74 7.49,5.72 7.53,5.71 7.57,5.69 7.61,5.68 7.65,5.67 7.69,5.66 7.74,5.65 7.43,5.34 7.42,5.39 7.4,5.47 7.39,5.51 7.37,5.55 7.35,5.59 7.34,5.62 7.31,5.65 7.29,5.68 7.27,5.71 ; 12.3,96.58 12.33,96.73 12.62,96.74 12.52,96.47 12.51,96.49 12.49,96.51 12.48,96.53 12.46,96.54 12.44,96.55 12.42,96.56 12.39,96.57 12.36,96.57 12.33,96.58 12.3,96.58
  Inner 1 w0.15: v4(7.7,5.38) 5.96,7.12 5.96,91.96 10.68,96.68 12.57,96.68 v6(12.7,96.55)
  Inner 4 w0.15: v6(12.7,96.55) 13,96.26 14.32,96.26 15.47,95.11 24.23,95.11 25.19,96.07 26.64,96.07 27.82,97.24 34.64,97.24 35.59,98.19 ; 45.33,99.95 45.33,94.85 44.58,94.1 41.88,94.1 37.79,98.19
Y3: length 42
  Bottom Layer w0.15: v6(11.93,96.25) 12.03,96.15 12.85,96.15 12.9,96.2 14.25,96.2 15.8,94.65 24.53,94.65 25.46,95.59 26.84,95.59 28.01,96.76 34.84,96.76 35.79,97.72 37.59,97.72 41.65,93.65 44.5,93.65 45.65,94.8 45.65,98.98
Y4: length 173.5
  Inner 1 w0.15: v6(11.12,96.03) 10.39,96.03 6.2,91.83 6.2,14.02 6.43,13.8 6.43,10.45 v4(7.7,9.18)
  Inner 3 w0.15: 11.15,96.03 11.3,95.88 13.28,95.88 13.73,95.43 14.25,95.43 14.67,95.01 24.38,95.01 25.32,95.94 26.69,95.94 27.87,97.12 34.69,97.12 35.64,98.07 ; 37.74,98.07 41.8,94 44.3,94 45.33,95.03 45.33,99.3
  Bottom Layer w0.2: 111.2,9.18 111.9,9.18 ; 58,5.38 58.7,5.38 ; 92.2,9.18 92.9,9.18 ; 24.5,5.38 23.8,5.38 ; 16.2,5.38 16.9,5.38 ; 20,5.38 20.7,5.38 ; 103.6,9.18 104.3,9.18 ; 8.6,5.38 9.3,5.38 ; 99.8,9.18 100.5,9.18 ; 69.4,9.18 70.1,9.18 ; 80.8,5.38 81.5,5.38 ; 118.8,5.38 119.5,5.38 ; 46.6,9.18 47.3,9.18 ; 88.4,5.38 89.1,5.38 ; 27.6,9.18 28.3,9.18 ; 88.4,9.18 89.1,9.18 ; 39,9.18 39.7,9.18 ; 31.4,9.18 32.1,9.18 ; 50.4,9.18 51.1,9.18 ; 35.2,5.38 35.9,5.38 ; 12.4,5.38 13.1,5.38 ; 99.8,5.38 100.5,5.38 ; 27.6,5.38 28.3,5.38 ; 54.2,9.18 54.9,9.18 ; 107.4,9.18 108.1,9.18 ; 92.2,5.38 92.9,5.38 ; 24.5,9.18 23.8,9.18 ; 20,9.18 20.7,9.18 ; 84.6,5.38 85.3,5.38 ; 73.2,5.38 73.9,5.38 ; 12.4,9.18 13.1,9.18 ; 61.8,5.38 62.5,5.38 ; 77,9.18 77.7,9.18 ; 46.6,5.38 47.3,5.38 ; 42.8,5.38 43.5,5.38 ; 50.4,5.38 51.1,5.38 ; 35.2,9.18 35.9,9.18 ; 96,9.18 96.7,9.18 ; 65.6,5.38 66.3,5.38 ; 58,9.18 58.7,9.18 ; 107.4,5.38 108.1,5.38 ; 84.6,9.18 85.3,9.18 ; 54.2,5.38 54.9,5.38 ; 122.6,5.38 123.3,5.38 ; 42.8,9.18 43.5,9.18 ; 111.2,5.38 111.9,5.38 ; 115,5.38 115.7,5.38 ; 73.2,9.18 73.9,9.18 ; 103.6,5.38 104.3,5.38 ; 16.2,9.18 16.9,9.18 ; 69.4,5.38 70.1,5.38 ; 77,5.38 77.7,5.38 ; 115,9.18 115.7,9.18 ; 39,5.38 39.7,5.38 ; 118.8,9.18 119.5,9.18 ; 31.4,5.38 32.1,5.38 ; 80.8,9.18 81.5,9.18 ; 122.6,9.18 123.3,9.18 ; 8.6,9.18 9.3,9.18 ; 96,5.38 96.7,5.38 ; 61.8,9.18 62.5,9.18 ; 65.6,9.18 66.3,9.18
Y5: length 148.2
  Inner 1 w0.15: v6(10.48,95.58) 10.3,95.58 6.45,91.73 6.45,14.13 v4(7.6,12.98)
  Inner 4 w0.15: 37.68,97.93 41.75,93.85 44.7,93.85 45.98,95.13 45.98,99.95 ; 35.7,97.93 34.75,96.98 27.93,96.98 26.75,95.8 25.38,95.8 24.44,94.87 14.76,94.87 14.2,95.43 13.68,95.43 13.3,95.8 12.85,95.8 12.62,95.58 v6(10.48,95.58)
  Bottom Layer w0.2: 42.8,12.98 43.5,12.98 ; 39,12.98 39.7,12.98 ; 20,12.98 20.7,12.98 ; 103.6,12.98 104.3,12.98 ; 115,12.98 115.7,12.98 ; 8.6,12.98 9.3,12.98 ; 122.6,12.98 123.3,12.98 ; 54.2,12.98 54.9,12.98 ; 84.6,12.98 85.3,12.98 ; 16.2,12.98 16.9,12.98 ; 69.4,12.98 70.1,12.98 ; 73.2,12.98 73.9,12.98 ; 58,12.98 58.7,12.98 ; 111.2,12.98 111.9,12.98 ; 107.4,12.98 108.1,12.98 ; 65.6,12.98 66.3,12.98 ; 88.4,12.98 89.1,12.98 ; 99.8,12.98 100.5,12.98 ; 50.4,12.98 51.1,12.98 ; 35.2,12.98 35.9,12.98 ; 27.6,12.98 28.3,12.98 ; 80.8,12.98 81.5,12.98 ; 31.4,12.98 32.1,12.98 ; 77,12.98 77.7,12.98 ; 61.8,12.98 62.5,12.98 ; 92.2,12.98 92.9,12.98 ; 46.6,12.98 47.3,12.98 ; 96,12.98 96.7,12.98 ; 118.8,12.98 119.5,12.98 ; 12.4,12.98 13.1,12.98
Y6: length 160.4
  Top Layer w0.15: v4(7.6,16.78) 6.45,17.93 6.45,21.39 6.19,21.65 6.19,25.11 5.95,25.35 5.95,28.81 5.71,29.06 5.71,32.52 5.49,32.73 5.49,36.19 5.25,36.43 5.25,39.99 5.01,40.23 5.01,92.15 5.25,92.39 5.25,92.4 5.49,92.64 5.49,92.66 5.71,92.87 5.71,92.89 5.95,93.13 5.95,93.14 6.19,93.38 6.19,93.4 6.45,93.66 6.45,93.67 7.97,95.2 10.65,95.2 11.1,95.65 12.6,95.65 12.75,95.8 v6(14.08,95.8)
  Bottom Layer w0.15: v6(14.08,95.8) 15.47,94.41 24.63,94.41 25.57,95.34 26.94,95.34 28.12,96.52 34.94,96.52 35.89,97.47 37.49,97.47 41.55,93.4 44.6,93.4 45.98,94.78 45.98,100.6
  Bottom Layer w0.2: 24.5,35.78 23.8,35.78 ; 77,16.78 77.7,16.78 ; 24.5,31.98 23.8,31.98 ; 118.8,16.78 119.5,16.78 ; 24.5,81.38 23.8,81.38 ; 12.4,16.78 13.1,16.78 ; 50.4,16.78 51.1,16.78 ; 84.6,16.78 85.3,16.78 ; 31.4,16.78 32.1,16.78 ; 107.4,16.78 108.1,16.78 ; 96,16.78 96.7,16.78 ; 42.8,16.78 43.5,16.78 ; 24.5,43.38 23.8,43.38 ; 24.5,66.18 23.8,66.18 ; 88.4,16.78 89.1,16.78 ; 24.5,47.18 23.8,47.18 ; 28.3,16.78 27.6,16.78 ; 115,16.78 115.7,16.78 ; 24.5,28.18 23.8,28.18 ; 103.6,16.78 104.3,16.78 ; 73.2,16.78 73.9,16.78 ; 24.5,16.78 23.8,16.78 ; 46.6,16.78 47.3,16.78 ; 16.2,16.78 16.9,16.78 ; 69.4,16.78 70.1,16.78 ; 24.5,54.78 23.8,54.78 ; 65.6,16.78 66.3,16.78 ; 24.5,39.58 23.8,39.58 ; 122.6,16.78 123.3,16.78 ; 39,16.78 39.7,16.78 ; 80.8,16.78 81.5,16.78 ; 24.5,73.78 23.8,73.78 ; 35.2,16.78 35.9,16.78 ; 54.2,16.78 54.9,16.78 ; 24.5,62.38 23.8,62.38 ; 61.8,16.78 62.5,16.78 ; 24.5,77.58 23.8,77.58 ; 99.8,16.78 100.5,16.78 ; 20,16.78 20.7,16.78 ; 58,16.78 58.7,16.78 ; 24.5,85.18 23.8,85.18 ; 92.2,16.78 92.9,16.78 ; 111.2,16.78 111.9,16.78 ; 24.5,50.98 23.8,50.98 ; 8.6,16.78 9.3,16.78
Y7: length 144.4
  Top Layer w0.15: v6(13.05,95.4) 11.23,95.4 10.77,94.95 8.08,94.95 6.43,93.3 6.43,93.28 6.19,93.04 6.19,93.03 5.95,92.79 5.95,92.77 5.73,92.56 5.73,92.54 5.49,92.3 5.49,92.29 5.25,92.05 5.25,40.33 5.49,40.09 5.49,36.53 5.73,36.29 5.73,32.83 5.95,32.62 5.95,29.15 6.19,28.91 6.19,25.45 6.43,25.21 6.43,21.75 v4(7.6,20.58)
  Inner 3 w0.15: 46.3,98.98 46.3,95.25 44.53,93.48 41.58,93.48 37.52,97.54 35.86,97.54 34.91,96.59 28.09,96.59 26.91,95.41 25.54,95.41 24.6,94.48 13.98,94.48 v6(13.05,95.4)
  Bottom Layer w0.2: 80.8,20.58 81.5,20.58 ; 107.4,20.58 108.1,20.58 ; 69.4,20.58 70.1,20.58 ; 8.6,20.58 9.3,20.58 ; 20,20.58 20.7,20.58 ; 54.2,20.58 54.9,20.58 ; 84.6,20.58 85.3,20.58 ; 31.4,20.58 32.1,20.58 ; 12.4,20.58 13.1,20.58 ; 27.6,20.58 28.3,20.58 ; 103.6,20.58 104.3,20.58 ; 16.2,20.58 16.9,20.58 ; 115,20.58 115.7,20.58 ; 46.6,20.58 47.3,20.58 ; 73.2,20.58 73.9,20.58 ; 77,20.58 77.7,20.58 ; 96,20.58 96.7,20.58 ; 24.5,20.58 23.8,20.58 ; 61.8,20.58 62.5,20.58 ; 58,20.58 58.7,20.58 ; 111.2,20.58 111.9,20.58 ; 88.4,20.58 89.1,20.58 ; 65.6,20.58 66.3,20.58 ; 35.2,20.58 35.9,20.58 ; 50.4,20.58 51.1,20.58 ; 118.8,20.58 119.5,20.58 ; 122.6,20.58 123.3,20.58 ; 42.8,20.58 43.5,20.58 ; 39,20.58 39.7,20.58 ; 92.2,20.58 92.9,20.58 ; 99.8,20.58 100.5,20.58
Y8: length 137.2
  Top Layer w0.15: 8.18,94.7 10.87,94.7 11.2,95.03 v6(13.98,95.03) ; v4(7.6,24.38) 6.43,25.55 6.43,29.01 6.19,29.25 6.19,32.71 5.97,32.93 5.97,36.39 5.73,36.63 5.73,40.19 5.49,40.43 5.49,91.95 5.73,92.19 5.73,92.21 5.97,92.44 5.97,92.46 6.19,92.67 6.19,92.69 6.43,92.93 6.43,92.94
  Inner 3 w0.15: v6(13.98,95.03) 14.26,94.74 24.49,94.74 25.43,95.68 26.8,95.68 27.98,96.85 34.8,96.85 35.75,97.8 37.63,97.8 41.68,93.75 44.43,93.75 45.98,95.3 45.98,99.3
  Bottom Layer w0.2: 42.8,24.38 43.5,24.38 ; 16.2,24.38 16.9,24.38 ; 111.2,24.38 111.9,24.38 ; 92.2,24.38 92.9,24.38 ; 46.6,24.38 47.3,24.38 ; 61.8,24.38 62.5,24.38 ; 118.8,24.38 119.5,24.38 ; 65.6,24.38 66.3,24.38 ; 54.2,24.38 54.9,24.38 ; 50.4,24.38 51.1,24.38 ; 122.6,24.38 123.3,24.38 ; 80.8,24.38 81.5,24.38 ; 115,24.38 115.7,24.38 ; 99.8,24.38 100.5,24.38 ; 12.4,24.38 13.1,24.38 ; 107.4,24.38 108.1,24.38 ; 24.5,24.38 23.8,24.38 ; 88.4,24.38 89.1,24.38 ; 69.4,24.38 70.1,24.38 ; 27.6,24.38 28.3,24.38 ; 31.4,24.38 32.1,24.38 ; 77,24.38 77.7,24.38 ; 84.6,24.38 85.3,24.38 ; 103.6,24.38 104.3,24.38 ; 96,24.38 96.7,24.38 ; 20,24.38 20.7,24.38 ; 73.2,24.38 73.9,24.38 ; 8.6,24.38 9.3,24.38 ; 39,24.38 39.7,24.38 ; 35.2,24.38 35.9,24.38 ; 58,24.38 58.7,24.38
Y9: length 135.9
  Top Layer w0.15: v6(13.23,94.6) 13.05,94.78 11.3,94.78 10.97,94.45 8.28,94.45 6.43,92.59 6.43,92.57 6.21,92.36 6.21,92.35 5.97,92.11 5.97,92.09 5.73,91.85 5.73,40.53 5.97,40.29 5.97,36.73 6.21,36.49 6.21,33.03 6.43,32.81 6.43,29.35 v4(7.6,28.18)
  Inner 4 w0.15: v6(13.23,94.6) 13.23,94.6 24.55,94.6 25.48,95.54 26.86,95.54 28.04,96.71 34.86,96.71 35.81,97.66 37.57,97.66 41.63,93.6 44.83,93.6 46.63,95.4 46.63,99.95
  Bottom Layer w0.2: 12.4,28.18 13.1,28.18 ; 69.4,28.18 70.1,28.18 ; 99.8,28.18 100.5,28.18 ; 88.4,28.18 89.1,28.18 ; 96,28.18 96.7,28.18 ; 61.8,28.18 62.5,28.18 ; 115,28.18 115.7,28.18 ; 50.4,28.18 51.1,28.18 ; 118.8,28.18 119.5,28.18 ; 20,28.18 20.7,28.18 ; 31.4,28.18 32.1,28.18 ; 111.2,28.18 111.9,28.18 ; 73.2,28.18 73.9,28.18 ; 46.6,28.18 47.3,28.18 ; 122.6,28.18 123.3,28.18 ; 107.4,28.18 108.1,28.18 ; 80.8,28.18 81.5,28.18 ; 54.2,28.18 54.9,28.18 ; 27.6,28.18 28.3,28.18 ; 16.2,28.18 16.9,28.18 ; 84.6,28.18 85.3,28.18 ; 58,28.18 58.7,28.18 ; 92.2,28.18 92.9,28.18 ; 103.6,28.18 104.3,28.18 ; 77,28.18 77.7,28.18 ; 35.2,28.18 35.9,28.18 ; 8.6,28.18 9.3,28.18 ; 65.6,28.18 66.3,28.18 ; 39,28.18 39.7,28.18 ; 42.8,28.18 43.5,28.18
Y10: length 129.9
  Top Layer w0.15: 6.45,92.26 6.45,92.25 6.21,92.01 6.21,91.99 5.97,91.75 5.97,40.63 6.21,40.39 6.21,36.83 6.45,36.59 6.45,33.13 v4(7.6,31.98) ; v6(11.6,94.38) 11.42,94.2 8.39,94.2
  Bottom Layer w0.15: v6(11.6,94.38) 11.7,94.48 12.68,94.48 13.01,94.14 24.74,94.14 25.68,95.08 27.05,95.08 28.23,96.25 35.05,96.25 36,97.2 37.38,97.2 41.43,93.15 44.7,93.15 46.63,95.08 46.63,100.6
  Bottom Layer w0.2: 84.6,31.98 85.3,31.98 ; 65.6,31.98 66.3,31.98 ; 35.2,31.98 35.9,31.98 ; 61.8,31.98 62.5,31.98 ; 42.8,31.98 43.5,31.98 ; 39,31.98 39.7,31.98 ; 46.6,31.98 47.3,31.98 ; 12.4,31.98 13.1,31.98 ; 69.4,31.98 70.1,31.98 ; 118.8,31.98 119.5,31.98 ; 88.4,31.98 89.1,31.98 ; 122.6,31.98 123.3,31.98 ; 99.8,31.98 100.5,31.98 ; 96,31.98 96.7,31.98 ; 80.8,31.98 81.5,31.98 ; 103.6,31.98 104.3,31.98 ; 73.2,31.98 73.9,31.98 ; 31.4,31.98 32.1,31.98 ; 77,31.98 77.7,31.98 ; 107.4,31.98 108.1,31.98 ; 8.6,31.98 9.3,31.98 ; 115,31.98 115.7,31.98 ; 16.2,31.98 16.9,31.98 ; 50.4,31.98 51.1,31.98 ; 58,31.98 58.7,31.98 ; 92.2,31.98 92.9,31.98 ; 54.2,31.98 54.9,31.98 ; 27.6,31.98 28.3,31.98 ; 20,31.98 20.7,31.98 ; 111.2,31.98 111.9,31.98
Y11: length 123.8
  Top Layer w0.15: v6(12.5,94.1) 12.35,93.95 8.49,93.95 ; 6.45,91.91 6.45,91.89 6.21,91.65 6.21,40.73 6.45,40.49 6.45,37.56 arc(6.57,36.98) 6.89,36.48 v4(7.6,35.78)
  Inner 4 w0.15: 46.95,98.98 46.95,95.35 44.95,93.35 41.5,93.35 37.46,97.4 35.92,97.4 34.97,96.45 28.15,96.45 26.97,95.27 25.59,95.27 24.66,94.34 13.53,94.34 13.3,94.1 v6(12.5,94.1)
  Bottom Layer w0.2: 65.6,35.78 66.3,35.78 ; 61.8,35.78 62.5,35.78 ; 92.2,35.78 92.9,35.78 ; 115,35.78 115.7,35.78 ; 73.2,35.78 73.9,35.78 ; 88.4,35.78 89.1,35.78 ; 31.4,35.78 32.1,35.78 ; 80.8,35.78 81.5,35.78 ; 39,35.78 39.7,35.78 ; 50.4,35.78 51.1,35.78 ; 8.6,35.78 9.3,35.78 ; 12.4,35.78 13.1,35.78 ; 16.2,35.78 16.9,35.78 ; 103.6,35.78 104.3,35.78 ; 27.6,35.78 28.3,35.78 ; 54.2,35.78 54.9,35.78 ; 46.6,35.78 47.3,35.78 ; 118.8,35.78 119.5,35.78 ; 58,35.78 58.7,35.78 ; 42.8,35.78 43.5,35.78 ; 99.8,35.78 100.5,35.78 ; 96,35.78 96.7,35.78 ; 122.6,35.78 123.3,35.78 ; 111.2,35.78 111.9,35.78 ; 107.4,35.78 108.1,35.78 ; 35.2,35.78 35.9,35.78 ; 84.6,35.78 85.3,35.78 ; 77,35.78 77.7,35.78 ; 69.4,35.78 70.1,35.78 ; 20,35.78 20.7,35.78
Y12: length 119.5
  Top Layer w0.15: v4(7.7,39.58) 7.14,40.13 arc(6.63,40.9) 6.45,41.81 6.45,91.55 ; v6(13.58,93.7) 13.57,93.7 8.6,93.7
  Inner 3 w0.15: v6(13.58,93.7) 14.08,94.21 24.71,94.21 25.65,95.15 27.02,95.15 28.2,96.32 35.02,96.32 35.97,97.27 37.41,97.27 41.45,93.23 44.65,93.23 46.63,95.2 46.63,99.3
  Bottom Layer w0.2: 122.6,39.58 123.3,39.58 ; 8.6,39.58 9.3,39.58 ; 16.2,39.58 16.9,39.58 ; 31.4,39.58 32.1,39.58 ; 111.2,39.58 111.9,39.58 ; 96,39.58 96.7,39.58 ; 73.2,39.58 73.9,39.58 ; 20,39.58 20.7,39.58 ; 50.4,39.58 51.1,39.58 ; 69.4,39.58 70.1,39.58 ; 77,39.58 77.7,39.58 ; 80.8,39.58 81.5,39.58 ; 39,39.58 39.7,39.58 ; 35.2,39.58 35.9,39.58 ; 84.6,39.58 85.3,39.58 ; 46.6,39.58 47.3,39.58 ; 12.4,39.58 13.1,39.58 ; 88.4,39.58 89.1,39.58 ; 58,39.58 58.7,39.58 ; 92.2,39.58 92.9,39.58 ; 65.6,39.58 66.3,39.58 ; 107.4,39.58 108.1,39.58 ; 54.2,39.58 54.9,39.58 ; 99.8,39.58 100.5,39.58 ; 61.8,39.58 62.5,39.58 ; 103.6,39.58 104.3,39.58 ; 42.8,39.58 43.5,39.58 ; 118.8,39.58 119.5,39.58 ; 115,39.58 115.7,39.58 ; 27.6,39.58 28.3,39.58
Y13: length 160.3
  Top Layer w0.15: v6(126.95,94.2) 127.2,93.95 127.2,93 127.02,92.82 127.02,89.54 126.78,89.3 126.78,85.85 126.55,85.63 126.55,82.15 126.33,81.93 126.33,78.48 126.1,78.25 126.1,74.78 125.85,74.53 125.85,71.08 125.58,70.8 125.58,44.55 v4(124.4,43.38)
  Inner 4 w0.15: 47.28,99.95 47.28,96.88 50.38,93.78 55.68,93.78 59.05,97.15 60.06,97.15 62.19,95.01 70.04,95.01 70.34,94.71 84.56,94.71 85.2,94.08 100.6,94.08 101.13,93.55 126.35,93.55 126.95,94.15 v6(126.95,94.2)
  Bottom Layer w0.2: 46.6,43.38 47.3,43.38 ; 39,43.38 39.7,43.38 ; 111.2,43.38 111.9,43.38 ; 50.4,43.38 51.1,43.38 ; 118.8,43.38 119.5,43.38 ; 107.4,43.38 108.1,43.38 ; 31.4,43.38 32.1,43.38 ; 54.2,43.38 54.9,43.38 ; 103.6,43.38 104.3,43.38 ; 65.6,43.38 66.3,43.38 ; 99.8,43.38 100.5,43.38 ; 84.6,43.38 85.3,43.38 ; 16.2,43.38 16.9,43.38 ; 27.6,43.38 28.3,43.38 ; 88.4,43.38 89.1,43.38 ; 122.6,43.38 123.3,43.38 ; 58,43.38 58.7,43.38 ; 20,43.38 20.7,43.38 ; 69.4,43.38 70.1,43.38 ; 80.8,43.38 81.5,43.38 ; 12.4,43.38 13.1,43.38 ; 92.2,43.38 92.9,43.38 ; 96,43.38 96.7,43.38 ; 42.8,43.38 43.5,43.38 ; 8.6,43.38 9.3,43.38 ; 73.2,43.38 73.9,43.38 ; 35.2,43.38 35.9,43.38 ; 77,43.38 77.7,43.38 ; 115,43.38 115.7,43.38 ; 61.8,43.38 62.5,43.38
Y14: length 156.1
  Inner 1 w0.15: v4(124.4,47.18) 125.6,48.38 125.6,51.92 125.83,52.15 125.83,55.5 126.08,55.75 126.08,59.19 126.33,59.44 126.33,62.89 126.58,63.14 126.58,66.59 126.95,66.96 126.95,93.35 v6(126.83,93.48)
  Bottom Layer w0.15: v6(126.83,93.48) 101.1,93.48 100.57,94.01 85.17,94.01 84.54,94.64 70.31,94.64 70.01,94.94 62.16,94.94 60.03,97.08 59.08,97.08 55.53,93.53 50.43,93.53 47.28,96.68 47.28,100.6
  Bottom Layer w0.2: 77,47.18 77.7,47.18 ; 35.2,47.18 35.9,47.18 ; 88.4,47.18 89.1,47.18 ; 115,47.18 115.7,47.18 ; 84.6,47.18 85.3,47.18 ; 54.2,47.18 54.9,47.18 ; 46.6,47.18 47.3,47.18 ; 8.6,47.18 9.3,47.18 ; 111.2,47.18 111.9,47.18 ; 50.4,47.18 51.1,47.18 ; 31.4,47.18 32.1,47.18 ; 20,47.18 20.7,47.18 ; 103.6,47.18 104.3,47.18 ; 80.8,47.18 81.5,47.18 ; 96,47.18 96.7,47.18 ; 61.8,47.18 62.5,47.18 ; 12.4,47.18 13.1,47.18 ; 27.6,47.18 28.3,47.18 ; 16.2,47.18 16.9,47.18 ; 92.2,47.18 92.9,47.18 ; 107.4,47.18 108.1,47.18 ; 118.8,47.18 119.5,47.18 ; 42.8,47.18 43.5,47.18 ; 73.2,47.18 73.9,47.18 ; 39,47.18 39.7,47.18 ; 122.6,47.18 123.3,47.18 ; 69.4,47.18 70.1,47.18 ; 99.8,47.18 100.5,47.18 ; 58,47.18 58.7,47.18 ; 65.6,47.18 66.3,47.18
Y15: length 149.8
  Inner 1 w0.15: v6(125.75,93.95) 126.7,93 126.7,67.06 126.33,66.69 126.33,63.24 126.08,62.99 126.08,59.55 125.83,59.3 125.83,55.85 125.58,55.6 125.58,52.25 v4(124.3,50.98)
  Inner 3 w0.15: 47.6,98.98 47.6,97.03 50.73,93.9 55.3,93.9 58.9,97.5 60.2,97.5 62.34,95.37 70.19,95.37 70.49,95.07 84.71,95.07 85.35,94.43 100.75,94.43 101.28,93.91 125.7,93.91 v6(125.75,93.95)
  Bottom Layer w0.2: 122.6,50.98 123.3,50.98 ; 118.8,50.98 119.5,50.98 ; 107.4,50.98 108.1,50.98 ; 58,50.98 58.7,50.98 ; 80.8,50.98 81.5,50.98 ; 46.6,50.98 47.3,50.98 ; 8.6,50.98 9.3,50.98 ; 16.2,50.98 16.9,50.98 ; 42.8,50.98 43.5,50.98 ; 92.2,50.98 92.9,50.98 ; 39,50.98 39.7,50.98 ; 96,50.98 96.7,50.98 ; 31.4,50.98 32.1,50.98 ; 73.2,50.98 73.9,50.98 ; 61.8,50.98 62.5,50.98 ; 20,50.98 20.7,50.98 ; 27.6,50.98 28.3,50.98 ; 77,50.98 77.7,50.98 ; 88.4,50.98 89.1,50.98 ; 103.6,50.98 104.3,50.98 ; 111.2,50.98 111.9,50.98 ; 35.2,50.98 35.9,50.98 ; 54.2,50.98 54.9,50.98 ; 65.6,50.98 66.3,50.98 ; 69.4,50.98 70.1,50.98 ; 50.4,50.98 51.1,50.98 ; 12.4,50.98 13.1,50.98 ; 99.8,50.98 100.5,50.98 ; 84.6,50.98 85.3,50.98 ; 115,50.98 115.7,50.98
Y16: length 157.3
  Inner 1 w0.15: v4(124.4,54.78) 125.58,55.95 125.58,59.4 125.83,59.65 125.83,63.1 126.08,63.35 126.08,66.79 126.45,67.17 126.45,92.45 v6(125.83,93.08)
  Inner 3 w0.15: v6(125.83,93.08) 125.27,93.64 101.17,93.64 100.64,94.17 85.24,94.17 84.6,94.8 70.38,94.8 70.08,95.1 62.23,95.1 60.09,97.24 59.01,97.24 55.43,93.65 50.6,93.65 47.28,96.98 47.28,99.3
  Bottom Layer w0.2: 65.6,54.78 66.3,54.78 ; 58,54.78 58.7,54.78 ; 61.8,54.78 62.5,54.78 ; 99.8,54.78 100.5,54.78 ; 73.2,54.78 73.9,54.78 ; 8.6,54.78 9.3,54.78 ; 20,54.78 20.7,54.78 ; 111.2,54.78 123.3,54.78 122.6,54.78 ; 107.4,54.78 108.1,54.78 ; 84.6,54.78 85.3,54.78 ; 115,54.78 115.7,54.78 ; 46.6,54.78 47.3,54.78 ; 35.2,54.78 35.9,54.78 ; 27.6,54.78 28.3,54.78 ; 96,54.78 96.7,54.78 ; 16.2,54.78 16.9,54.78 ; 77,54.78 77.7,54.78 ; 50.4,54.78 51.1,54.78 ; 118.8,54.78 119.5,54.78 ; 80.8,54.78 81.5,54.78 ; 54.2,54.78 54.9,54.78 ; 103.6,54.78 104.3,54.78 ; 31.4,54.78 32.1,54.78 ; 69.4,54.78 70.1,54.78 ; 39,54.78 39.7,54.78 ; 42.8,54.78 43.5,54.78 ; 88.4,54.78 89.1,54.78 ; 12.4,54.78 13.1,54.78 ; 92.2,54.78 92.9,54.78
Y17: length 143.1
  Inner 1 w0.15: v4(124.4,58.58) 125.58,59.75 125.58,63.2 125.83,63.45 125.83,66.9 126.2,67.27 126.2,92.03 124.13,94.1 v6(124.13,94.55)
  Inner 4 w0.15: v6(124.13,94.55) 123.39,93.82 101.24,93.82 100.71,94.34 85.31,94.34 84.68,94.98 70.45,94.98 70.15,95.28 62.3,95.28 60.17,97.41 58.94,97.41 55.55,94.03 50.5,94.03 47.93,96.6 47.93,99.95
  Bottom Layer w0.2: 20,58.58 20.7,58.58 ; 16.2,58.58 16.9,58.58 ; 58,58.58 58.7,58.58 ; 69.4,58.58 70.1,58.58 ; 73.2,58.58 73.9,58.58 ; 39,58.58 39.7,58.58 ; 8.6,58.58 9.3,58.58 ; 54.2,58.58 54.9,58.58 ; 31.4,58.58 32.1,58.58 ; 27.6,58.58 28.3,58.58 ; 24.5,58.58 23.8,58.58 ; 118.8,58.58 119.5,58.58 ; 80.8,58.58 81.5,58.58 ; 42.8,58.58 43.5,58.58 ; 88.4,58.58 89.1,58.58 ; 111.2,58.58 111.9,58.58 ; 46.6,58.58 47.3,58.58 ; 61.8,58.58 62.5,58.58 ; 92.2,58.58 92.9,58.58 ; 50.4,58.58 51.1,58.58 ; 65.6,58.58 66.3,58.58 ; 107.4,58.58 108.1,58.58 ; 84.6,58.58 85.3,58.58 ; 115,58.58 115.7,58.58 ; 103.6,58.58 104.3,58.58 ; 35.2,58.58 35.9,58.58 ; 122.6,58.58 123.3,58.58 ; 96,58.58 96.7,58.58 ; 12.4,58.58 13.1,58.58 ; 77,58.58 77.7,58.58 ; 99.8,58.58 100.5,58.58
Y18: length 140
  Inner 1 w0.15: v4(124.4,62.38) 125.58,63.55 125.58,67 125.95,67.37 125.95,91.9 123.65,94.2 v6(123.65,95.23)
  Bottom Layer w0.15: v6(123.65,95.23) 123.18,95.23 121.68,93.73 101.2,93.73 100.68,94.25 85.28,94.25 84.64,94.89 70.41,94.89 70.11,95.19 62.26,95.19 60.13,97.33 58.97,97.33 55.43,93.78 50.55,93.78 47.93,96.4 47.93,100.6
  Bottom Layer w0.2: 61.8,62.38 62.5,62.38 ; 111.2,62.38 111.9,62.38 ; 92.2,62.38 92.9,62.38 ; 20,62.38 20.7,62.38 ; 115,62.38 115.7,62.38 ; 65.6,62.38 66.3,62.38 ; 103.6,62.38 104.3,62.38 ; 31.4,62.38 32.1,62.38 ; 12.4,62.38 13.1,62.38 ; 118.8,62.38 119.5,62.38 ; 99.8,62.38 100.5,62.38 ; 107.4,62.38 108.1,62.38 ; 16.2,62.38 16.9,62.38 ; 88.4,62.38 89.1,62.38 ; 69.4,62.38 70.1,62.38 ; 122.6,62.38 123.3,62.38 ; 35.2,62.38 35.9,62.38 ; 58,62.38 58.7,62.38 ; 42.8,62.38 43.5,62.38 ; 84.6,62.38 85.3,62.38 ; 77,62.38 77.7,62.38 ; 96,62.38 96.7,62.38 ; 27.6,62.38 28.3,62.38 ; 80.8,62.38 81.5,62.38 ; 46.6,62.38 47.3,62.38 ; 39,62.38 39.7,62.38 ; 8.6,62.38 9.3,62.38 ; 73.2,62.38 73.9,62.38 ; 54.2,62.38 54.9,62.38 ; 50.4,62.38 51.1,62.38
Y19: length 130.4
  Inner 1 w0.15: v4(124.4,66.18) 125.7,67.48 125.7,91.78 123.98,93.5 123.3,93.5 v6(121.75,95.05)
  Inner 3 w0.15: 58.68,98.03 55.05,94.4 51,94.4 48.25,97.15 48.25,98.98 ; v6(121.75,95.05) 121.75,95.03 121.16,94.44 101.49,94.44 100.97,94.96 85.57,94.96 84.93,95.6 70.71,95.6 70.41,95.9 62.56,95.9 60.42,98.03
  Bottom Layer w0.2: 42.8,66.18 43.5,66.18 ; 118.8,66.18 119.5,66.18 ; 84.6,66.18 85.3,66.18 ; 46.6,66.18 47.3,66.18 ; 92.2,66.18 92.9,66.18 ; 96,66.18 96.7,66.18 ; 111.2,66.18 111.9,66.18 ; 103.6,66.18 104.3,66.18 ; 61.8,66.18 62.5,66.18 ; 35.2,66.18 35.9,66.18 ; 58,66.18 58.7,66.18 ; 122.6,66.18 123.3,66.18 ; 88.4,66.18 89.1,66.18 ; 77,66.18 77.7,66.18 ; 54.2,66.18 54.9,66.18 ; 31.4,66.18 32.1,66.18 ; 69.4,66.18 70.1,66.18 ; 16.2,66.18 16.9,66.18 ; 12.4,66.18 13.1,66.18 ; 107.4,66.18 108.1,66.18 ; 39,66.18 39.7,66.18 ; 115,66.18 115.7,66.18 ; 50.4,66.18 51.1,66.18 ; 73.2,66.18 73.9,66.18 ; 65.6,66.18 66.3,66.18 ; 20,66.18 20.7,66.18 ; 80.8,66.18 81.5,66.18 ; 99.8,66.18 100.5,66.18 ; 8.6,66.18 9.3,66.18 ; 27.6,66.18 28.3,66.18
Y20: length 132.7
  Top Layer w0.15: v4(124.4,69.98) 125.58,71.15 125.58,74.61 125.82,74.85 125.82,78.31 126.06,78.55 126.06,82.02 126.3,82.25 126.3,85.72 126.54,85.96 126.54,89.42 126.78,89.66 126.78,92.88 126.45,93.2 v6(126.45,94.7)
  Inner 3 w0.15: 47.93,99.3 47.93,97.1 50.88,94.15 55.18,94.15 58.79,97.77 60.31,97.77 62.45,95.63 70.3,95.63 70.6,95.33 84.82,95.33 85.46,94.7 100.86,94.7 101.38,94.17 125.39,94.17 125.93,94.7 v6(126.45,94.7)
  Bottom Layer w0.2: 84.6,69.98 85.3,69.98 ; 122.6,69.98 123.3,69.98 ; 69.4,69.98 70.1,69.98 ; 65.6,69.98 66.3,69.98 ; 27.6,69.98 28.3,69.98 ; 61.8,69.98 62.5,69.98 ; 92.2,69.98 92.9,69.98 ; 80.8,69.98 81.5,69.98 ; 31.4,69.98 32.1,69.98 ; 111.2,69.98 111.9,69.98 ; 35.2,69.98 35.9,69.98 ; 107.4,69.98 108.1,69.98 ; 96,69.98 96.7,69.98 ; 20,69.98 20.7,69.98 ; 8.6,69.98 9.3,69.98 ; 50.4,69.98 51.1,69.98 ; 39,69.98 39.7,69.98 ; 73.2,69.98 73.9,69.98 ; 24.5,69.98 23.8,69.98 ; 103.6,69.98 104.3,69.98 ; 77,69.98 77.7,69.98 ; 46.6,69.98 47.3,69.98 ; 16.2,69.98 16.9,69.98 ; 58,69.98 58.7,69.98 ; 88.4,69.98 89.1,69.98 ; 54.2,69.98 54.9,69.98 ; 12.4,69.98 13.1,69.98 ; 115,69.98 115.7,69.98 ; 99.8,69.98 100.5,69.98 ; 118.8,69.98 119.5,69.98 ; 42.8,69.98 43.5,69.98
Y21: length 128
  Top Layer w0.15: v6(125.2,94.55) 125.73,94.55 126.2,94.08 126.2,93.08 126.54,92.74 126.54,89.76 126.3,89.52 126.3,86.06 126.06,85.81 126.06,82.35 125.82,82.11 125.82,78.65 125.58,78.41 125.58,74.95 v4(124.4,73.78)
  Inner 4 w0.15: 48.58,99.95 48.58,96.33 50.63,94.28 55.43,94.28 58.83,97.68 60.28,97.68 62.41,95.55 70.26,95.55 70.56,95.25 84.78,95.25 85.42,94.61 100.82,94.61 101.35,94.08 123.13,94.08 124,94.95 124.8,94.95 v6(125.2,94.55)
  Bottom Layer w0.2: 27.6,73.78 28.3,73.78 ; 77,73.78 77.7,73.78 ; 61.8,73.78 62.5,73.78 ; 99.8,73.78 100.5,73.78 ; 88.4,73.78 89.1,73.78 ; 73.2,73.78 73.9,73.78 ; 31.4,73.78 32.1,73.78 ; 46.6,73.78 47.3,73.78 ; 8.6,73.78 9.3,73.78 ; 65.6,73.78 66.3,73.78 ; 118.8,73.78 119.5,73.78 ; 69.4,73.78 70.1,73.78 ; 50.4,73.78 51.1,73.78 ; 35.2,73.78 35.9,73.78 ; 54.2,73.78 54.9,73.78 ; 115,73.78 115.7,73.78 ; 20,73.78 20.7,73.78 ; 39,73.78 39.7,73.78 ; 107.4,73.78 108.1,73.78 ; 58,73.78 58.7,73.78 ; 92.2,73.78 92.9,73.78 ; 84.6,73.78 85.3,73.78 ; 122.6,73.78 123.3,73.78 ; 12.4,73.78 13.1,73.78 ; 111.2,73.78 111.9,73.78 ; 96,73.78 96.7,73.78 ; 16.2,73.78 16.9,73.78 ; 80.8,73.78 81.5,73.78 ; 103.6,73.78 104.3,73.78 ; 42.8,73.78 43.5,73.78
Y22: length 125.3
  Top Layer w0.15: v6(124.43,95.33) 124.53,95.23 124.53,93.85 126.3,92.08 126.3,89.86 126.06,89.62 126.06,86.15 125.82,85.91 125.82,82.45 125.58,82.21 125.58,78.75 v4(124.4,77.58)
  Bottom Layer w0.15: v6(124.43,95.33) 124.15,95.6 123.2,95.6 121.57,93.98 101.3,93.98 100.78,94.5 85.38,94.5 84.74,95.14 70.52,95.14 70.22,95.44 62.37,95.44 60.23,97.57 58.87,97.57 55.33,94.03 50.65,94.03 48.58,96.1 48.58,100.6
  Bottom Layer w0.2: 73.2,77.58 73.9,77.58 ; 103.6,77.58 104.3,77.58 ; 46.6,77.58 47.3,77.58 ; 80.8,77.58 81.5,77.58 ; 99.8,77.58 100.5,77.58 ; 96,77.58 96.7,77.58 ; 20,77.58 20.7,77.58 ; 61.8,77.58 62.5,77.58 ; 65.6,77.58 66.3,77.58 ; 88.4,77.58 89.1,77.58 ; 50.4,77.58 51.1,77.58 ; 92.2,77.58 92.9,77.58 ; 31.4,77.58 32.1,77.58 ; 16.2,77.58 16.9,77.58 ; 35.2,77.58 35.9,77.58 ; 12.4,77.58 13.1,77.58 ; 77,77.58 77.7,77.58 ; 8.6,77.58 9.3,77.58 ; 27.6,77.58 28.3,77.58 ; 54.2,77.58 54.9,77.58 ; 39,77.58 39.7,77.58 ; 115,77.58 115.7,77.58 ; 58,77.58 58.7,77.58 ; 111.2,77.58 111.9,77.58 ; 84.6,77.58 85.3,77.58 ; 69.4,77.58 70.1,77.58 ; 118.8,77.58 119.5,77.58 ; 42.8,77.58 43.5,77.58 ; 122.6,77.58 123.3,77.58 ; 107.4,77.58 108.1,77.58
Y23: length 116.6
  Top Layer w0.15: v4(124.4,81.38) 125.58,82.55 125.58,86.01 125.82,86.25 125.82,89.71 126.06,89.95 126.06,91.95 123.48,94.53 123.48,94.7 122.75,95.43 v6(122.45,95.43)
  Bottom Layer w0.15: v6(122.45,95.43) 122.45,95.23 121.45,94.22 101.41,94.22 100.88,94.75 85.48,94.75 84.84,95.39 70.62,95.39 70.32,95.69 62.47,95.69 60.33,97.82 ; 48.9,98.98 48.9,96.15 50.78,94.28 55.23,94.28 58.77,97.82
  Bottom Layer w0.2: 39,81.38 39.7,81.38 ; 80.8,81.38 81.5,81.38 ; 12.4,81.38 13.1,81.38 ; 58,81.38 58.7,81.38 ; 27.6,81.38 28.3,81.38 ; 77,81.38 77.7,81.38 ; 96,81.38 96.7,81.38 ; 88.4,81.38 89.1,81.38 ; 103.6,81.38 104.3,81.38 ; 8.6,81.38 9.3,81.38 ; 54.2,81.38 54.9,81.38 ; 35.2,81.38 35.9,81.38 ; 99.8,81.38 100.5,81.38 ; 92.2,81.38 92.9,81.38 ; 73.2,81.38 73.9,81.38 ; 118.8,81.38 119.5,81.38 ; 84.6,81.38 85.3,81.38 ; 16.2,81.38 16.9,81.38 ; 65.6,81.38 66.3,81.38 ; 111.2,81.38 111.9,81.38 ; 50.4,81.38 51.1,81.38 ; 115,81.38 115.7,81.38 ; 31.4,81.38 32.1,81.38 ; 20,81.38 20.7,81.38 ; 46.6,81.38 47.3,81.38 ; 107.4,81.38 108.1,81.38 ; 69.4,81.38 70.1,81.38 ; 42.8,81.38 43.5,81.38 ; 122.6,81.38 123.3,81.38 ; 61.8,81.38 62.5,81.38
Y24: length 111.2
  Top Layer w0.15: v6(123.05,94.58) 123.08,94.58 125.82,91.84 125.82,90.05 125.58,89.81 125.58,86.35 v4(124.4,85.18)
  Inner 4 w0.15: v6(123.05,94.58) 122.82,94.35 101.46,94.35 100.93,94.87 85.53,94.87 84.89,95.51 70.67,95.51 70.37,95.81 62.52,95.81 60.39,97.94 ; 49.23,99.3 49.23,96.05 50.75,94.53 55.3,94.53 58.72,97.94
  Bottom Layer w0.2: 16.2,85.18 16.9,85.18 ; 31.4,85.18 32.1,85.18 ; 20,85.18 20.7,85.18 ; 103.6,85.18 104.3,85.18 ; 27.6,85.18 28.3,85.18 ; 77,85.18 77.7,85.18 ; 99.8,85.18 100.5,85.18 ; 12.4,85.18 13.1,85.18 ; 118.8,85.18 119.5,85.18 ; 69.4,85.18 70.1,85.18 ; 88.4,85.18 89.1,85.18 ; 122.6,85.18 123.3,85.18 ; 84.6,85.18 85.3,85.18 ; 42.8,85.18 43.5,85.18 ; 65.6,85.18 66.3,85.18 ; 80.8,85.18 81.5,85.18 ; 58,85.18 58.7,85.18 ; 39,85.18 39.7,85.18 ; 35.2,85.18 35.9,85.18 ; 61.8,85.18 62.5,85.18 ; 92.2,85.18 92.9,85.18 ; 50.4,85.18 51.1,85.18 ; 73.2,85.18 73.9,85.18 ; 115,85.18 115.7,85.18 ; 54.2,85.18 54.9,85.18 ; 107.4,85.18 108.1,85.18 ; 8.6,85.18 9.3,85.18 ; 96,85.18 96.7,85.18 ; 111.2,85.18 111.9,85.18 ; 46.6,85.18 47.3,85.18
